# EAGLE design rekick2015-Prototyp-Sperrwandler (EAGLE 7.5.0)

## Sheet 1 of 7: Spannungsversorgung Primärseite
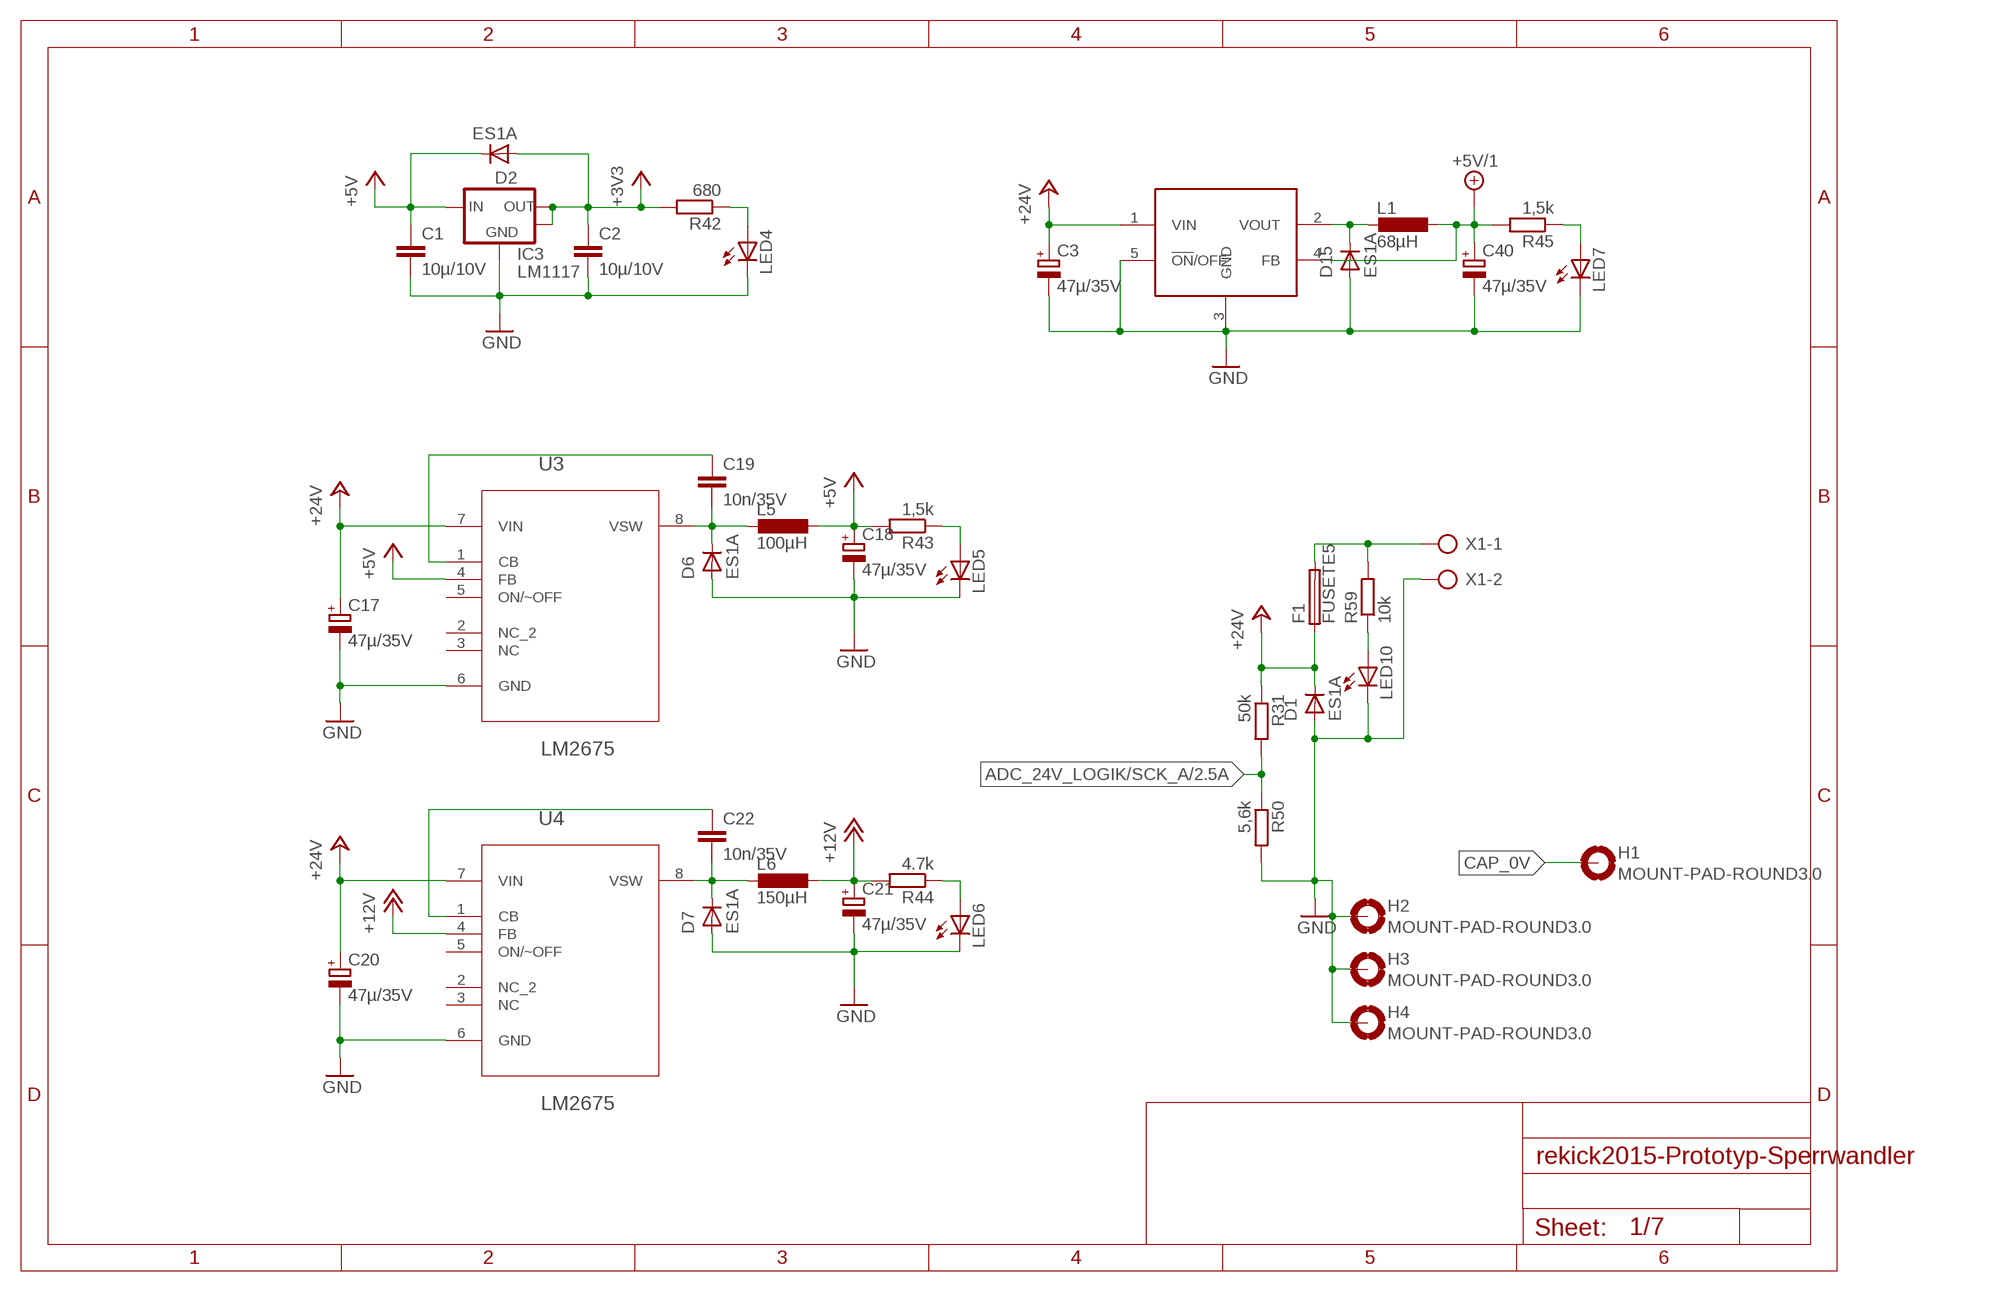
[diagram p0: schematic, sheet 1]

### Parts
C1  10µ/10V  C-EUC0603  [C0603]
C2  10µ/10V  C-EUC0603  [C0603]
C3  47µ/35V  CPOL-EUD  [PANASONIC_D]
C17  47µ/35V  CPOL-EUD  [PANASONIC_D]
C18  47µ/35V  CPOL-EUD  [PANASONIC_D]
C19  10n/35V  C-EUC0603  [C0603]
C20  47µ/35V  CPOL-EUD  [PANASONIC_D]
C21  47µ/35V  CPOL-EUD  [PANASONIC_D]
C22  10n/35V  C-EUC0603  [C0603]
C40  47µ/35V  CPOL-EUD  [PANASONIC_D]
D1  ES1A  GF1  [SMA-DO214AC]
D2  ES1A  GF1  [SMA-DO214AC]
D6  ES1A  GF1  [SMA-DO214AC]
D7  ES1A  GF1  [SMA-DO214AC]
D15  ES1A  GF1  [SMA-DO214AC]
F1  FUSETE5  [TE5]
H1  MOUNT-PAD-ROUND3.0  [3,0-PAD]
H2  MOUNT-PAD-ROUND3.0  [3,0-PAD]
H3  MOUNT-PAD-ROUND3.0  [3,0-PAD]
H4  MOUNT-PAD-ROUND3.0  [3,0-PAD]
IC3  LM1117  [SOT223]
L1  68µH  L-EUPISM  [PISM]
L5  100µH  L-EUPISM  [PISM]
L6  150µH  L-EUPISM  [PISM]
LED4  LEDCHIP-LED0805  [CHIP-LED0805]
LED5  LEDCHIP-LED0805  [CHIP-LED0805]
LED6  LEDCHIP-LED0805  [CHIP-LED0805]
LED7  LEDCHIP-LED0805  [CHIP-LED0805]
LED10  LEDCHIP-LED0805  [CHIP-LED0805]
R31  50k  R-EU_R0805  [R0805]
R42  680  R-EU_R0805  [R0805]
R43  1,5k  R-EU_R0805  [R0805]
R44  4.7k  R-EU_R0805  [R0805]
R45  1,5k  R-EU_R0805  [R0805]
R50  5,6k  R-EU_R0805  [R0805]
R59  10k  R-EU_R0805  [R0805]
U3  LM2675  LM2675M-3.3  [SOIC127P620X175-8N]
U4  LM2675  LM2675M-3.3  [SOIC127P620X175-8N]
U$8  LM2576  [TO220511]
X1  AK500/2-H  [AK500/2-H]

### Nets
+3V3: C2.1 D2.A IC3.2(OUT) IC3.4(OUT) R42.2 ; also sheet 3
+5V: C1.1 C18.+ D2.K(C) IC3.3(IN) L5.1 R43.2 U3.4(FB) ; also sheet 2,3,4,6,7
+5V/1: C40.+ L1.1 R45.2 U$8.4(FB) ; also sheet 6
+12V: C21.+ L6.1 R44.2 U4.4(FB)
+24V: C3.+ C17.+ C20.+ D1.K(C) F1.1 R31.1 U3.7(VIN) U4.7(VIN) U$8.1(VIN) ; also sheet 4,7
ADC_24V_LOGIK/SCK_A: R31.2 R50.1 ; also sheet 2
CAP_0V: H1.B3,0(MOUNT) ; also sheet 5,6,7
GND: C1.2 C2.2 C3.- C17.- C18.- C20.- C21.- C40.- D1.A D6.A D7.A D15.A H2.B3,0(MOUNT) H3.B3,0(MOUNT) H4.B3,0(MOUNT) IC3.1(GND) LED4.C LED5.C LED6.C LED7.C LED10.C R50.2 U3.6(GND) U4.6(GND) U$8.3(GND) U$8.5(!ON!/OFF) X1.2 ; also sheet 2,3,4,5,6,7
N$1: C19.2 D6.K(C) L5.2 U3.8(VSW)
N$3: C19.1 U3.1(CB)
N$26: C22.2 D7.K(C) L6.2 U4.8(VSW)
N$30: F1.2 R59.2 X1.1
N$33: C22.1 U4.1(CB)
N$67: LED4.A R42.1
N$69: D15.K(C) L1.2 U$8.2(VOUT)
N$71: LED7.A R45.1
N$72: LED5.A R43.1
N$73: LED6.A R44.1
N$77: LED10.A R59.1
Unconnected: U3.2(NC_2) U3.3(NC) U3.5(ON/~OFF) U4.2(NC_2) U4.3(NC) U4.5(ON/~OFF)

## Sheet 2 of 7: MCU
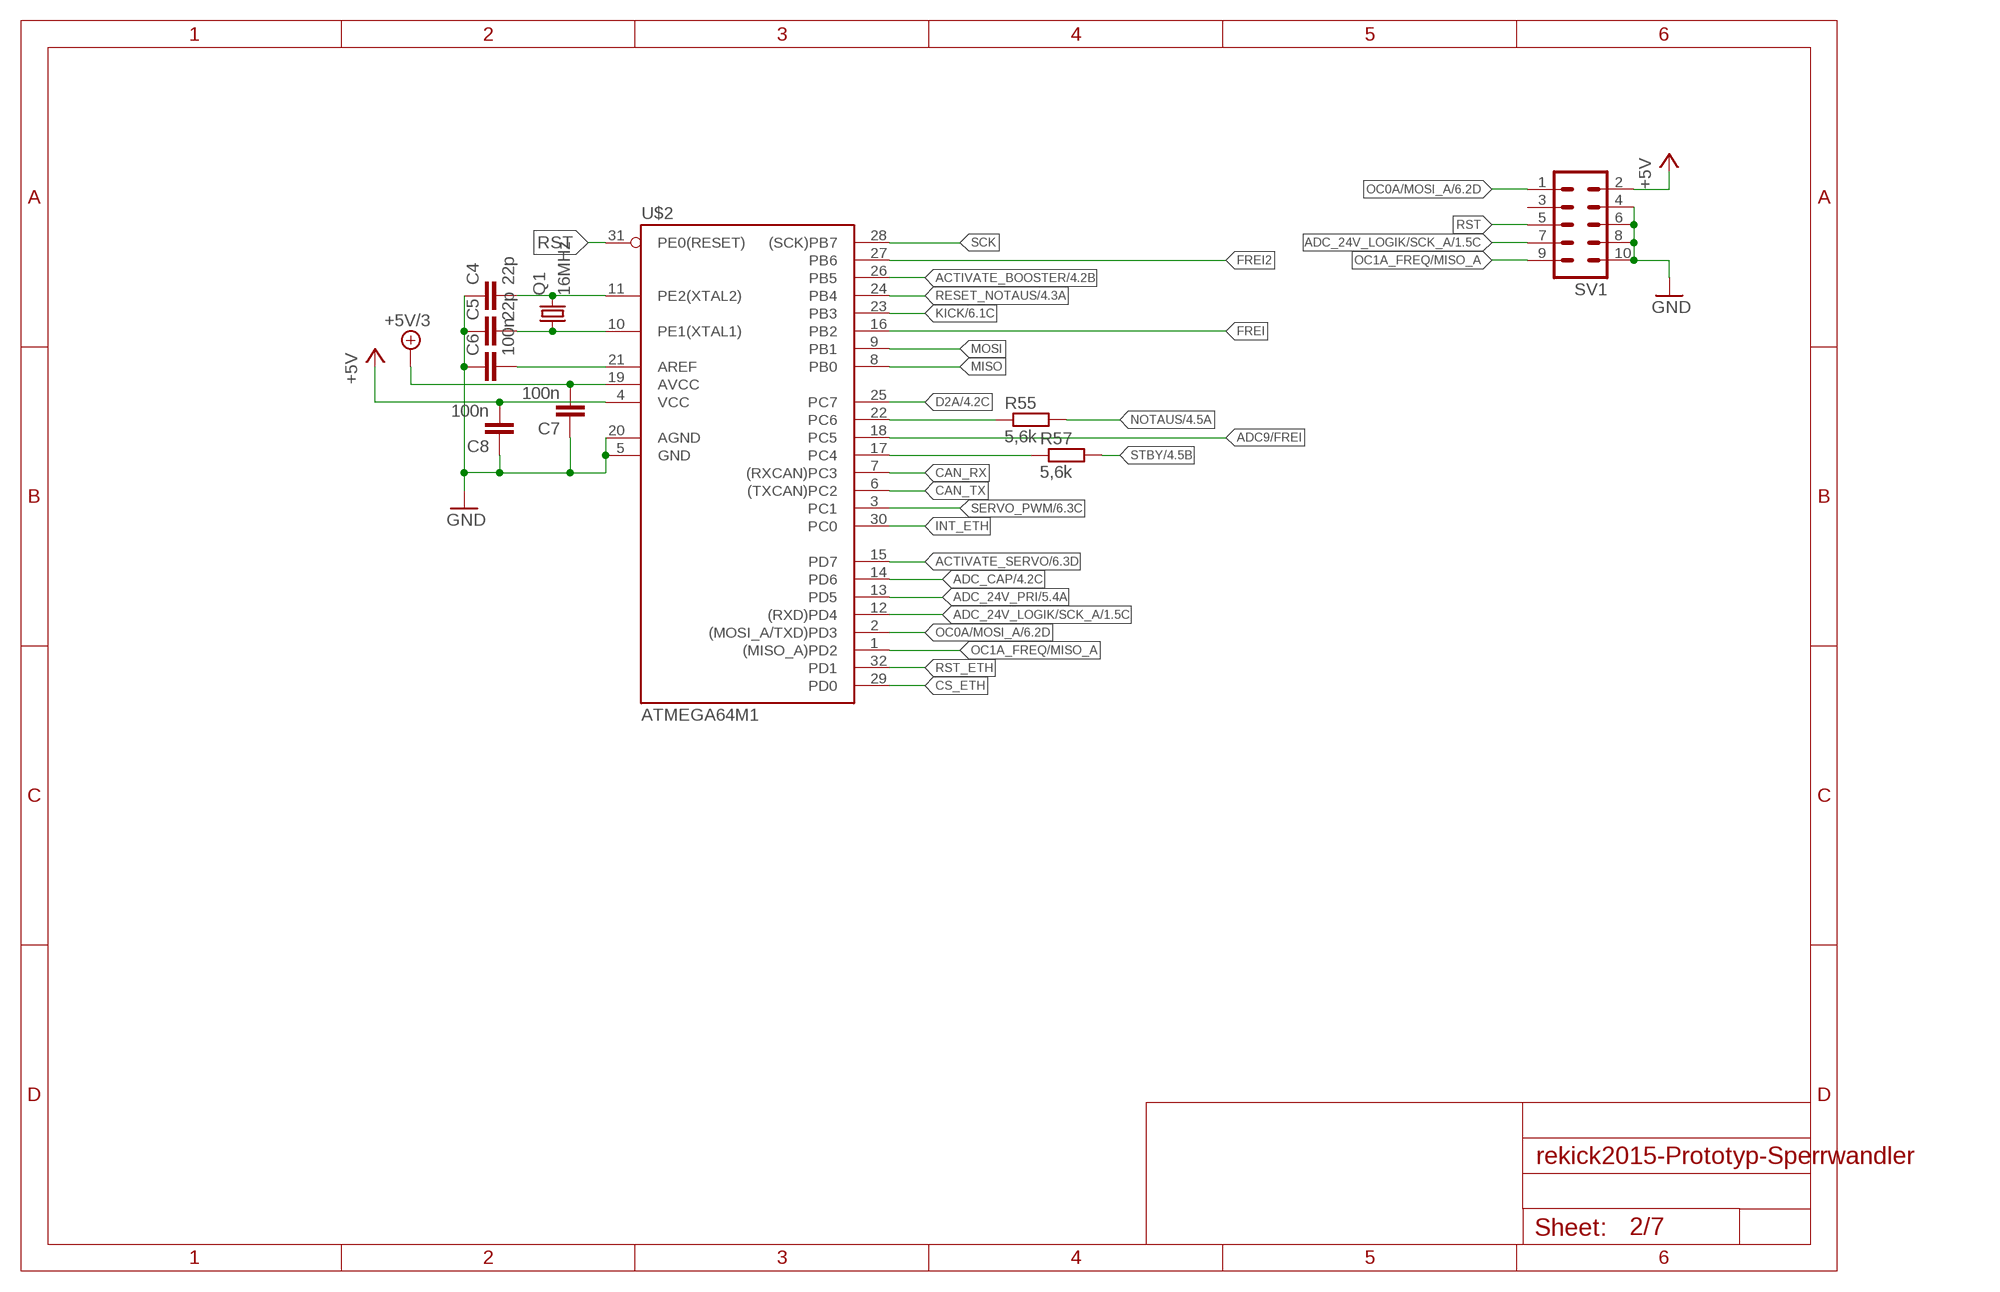
[diagram p1: schematic, sheet 2]

### Parts
C4  22p  C-EUC0603  [C0603]
C5  22p  C-EUC0603  [C0603]
C6  100n  C-EUC0603  [C0603]
C7  100n  C-EUC0603  [C0603]
C8  100n  C-EUC0603  [C0603]
Q1  16MHz  CRYSTALHC49UP  [HC49UP]
R55  5,6k  R-EU_R0805  [R0805]
R57  5,6k  R-EU_R0805  [R0805]
SV1  ML10  [ML10]
U$2  ATMEGA64M1  [TQFP32-08]

### Nets
+5V: C8.2 SV1.2 U$2.4(VCC) ; also sheet 1,3,4,6,7
+5V/3: C7.2 U$2.19(AVCC) ; also sheet 4,7
ACTIVATE_BOOSTER: U$2.26(PB5) ; also sheet 4,5
ACTIVATE_SERVO: U$2.15(PD7) ; also sheet 6
ADC9/FREI: U$2.18(PC5)
ADC_24V_LOGIK/SCK_A: SV1.7 U$2.12((RXD)PD4) ; also sheet 1
ADC_24V_PRI: U$2.13(PD5) ; also sheet 5
ADC_CAP: U$2.14(PD6) ; also sheet 4,7
CAN_RX: U$2.7((RXCAN)PC3) ; also sheet 3
CAN_TX: U$2.6((TXCAN)PC2) ; also sheet 3
CS_ETH: U$2.29(PD0) ; also sheet 3
D2A: U$2.25(PC7) ; also sheet 4
FREI: U$2.16(PB2)
FREI2: U$2.27(PB6)
GND: C4.1 C5.1 C6.1 C7.1 C8.1 SV1.4 SV1.6 SV1.8 SV1.10 U$2.5(GND) U$2.20(AGND) ; also sheet 1,3,4,5,6,7
INT_ETH: U$2.30(PC0) ; also sheet 3
KICK: U$2.23(PB3) ; also sheet 6
MISO: U$2.8(PB0) ; also sheet 3
MOSI: U$2.9(PB1) ; also sheet 3
N$5: C4.2 Q1.2 U$2.11(PE2(XTAL2))
N$6: C5.2 Q1.1 U$2.10(PE1(XTAL1))
N$10: C6.2 U$2.21(AREF)
N$51: R55.1 U$2.22(PC6)
N$59: R57.1 U$2.17(PC4)
NOTAUS: R55.2 ; also sheet 4,6
OC0A/MOSI_A: SV1.1 U$2.2((MOSI_A/TXD)PD3) ; also sheet 6
OC1A_FREQ/MISO_A: SV1.9 U$2.1((MISO_A)PD2)
RESET_NOTAUS: U$2.24(PB4) ; also sheet 4
RST: SV1.5 U$2.31(PE0(RESET))
RST_ETH: U$2.32(PD1) ; also sheet 3
SCK: U$2.28((SCK)PB7) ; also sheet 3
SERVO_PWM: U$2.3(PC1) ; also sheet 6
STBY: R57.2 ; also sheet 4
Unconnected: SV1.3

## Sheet 3 of 7: Ethernet & CAN
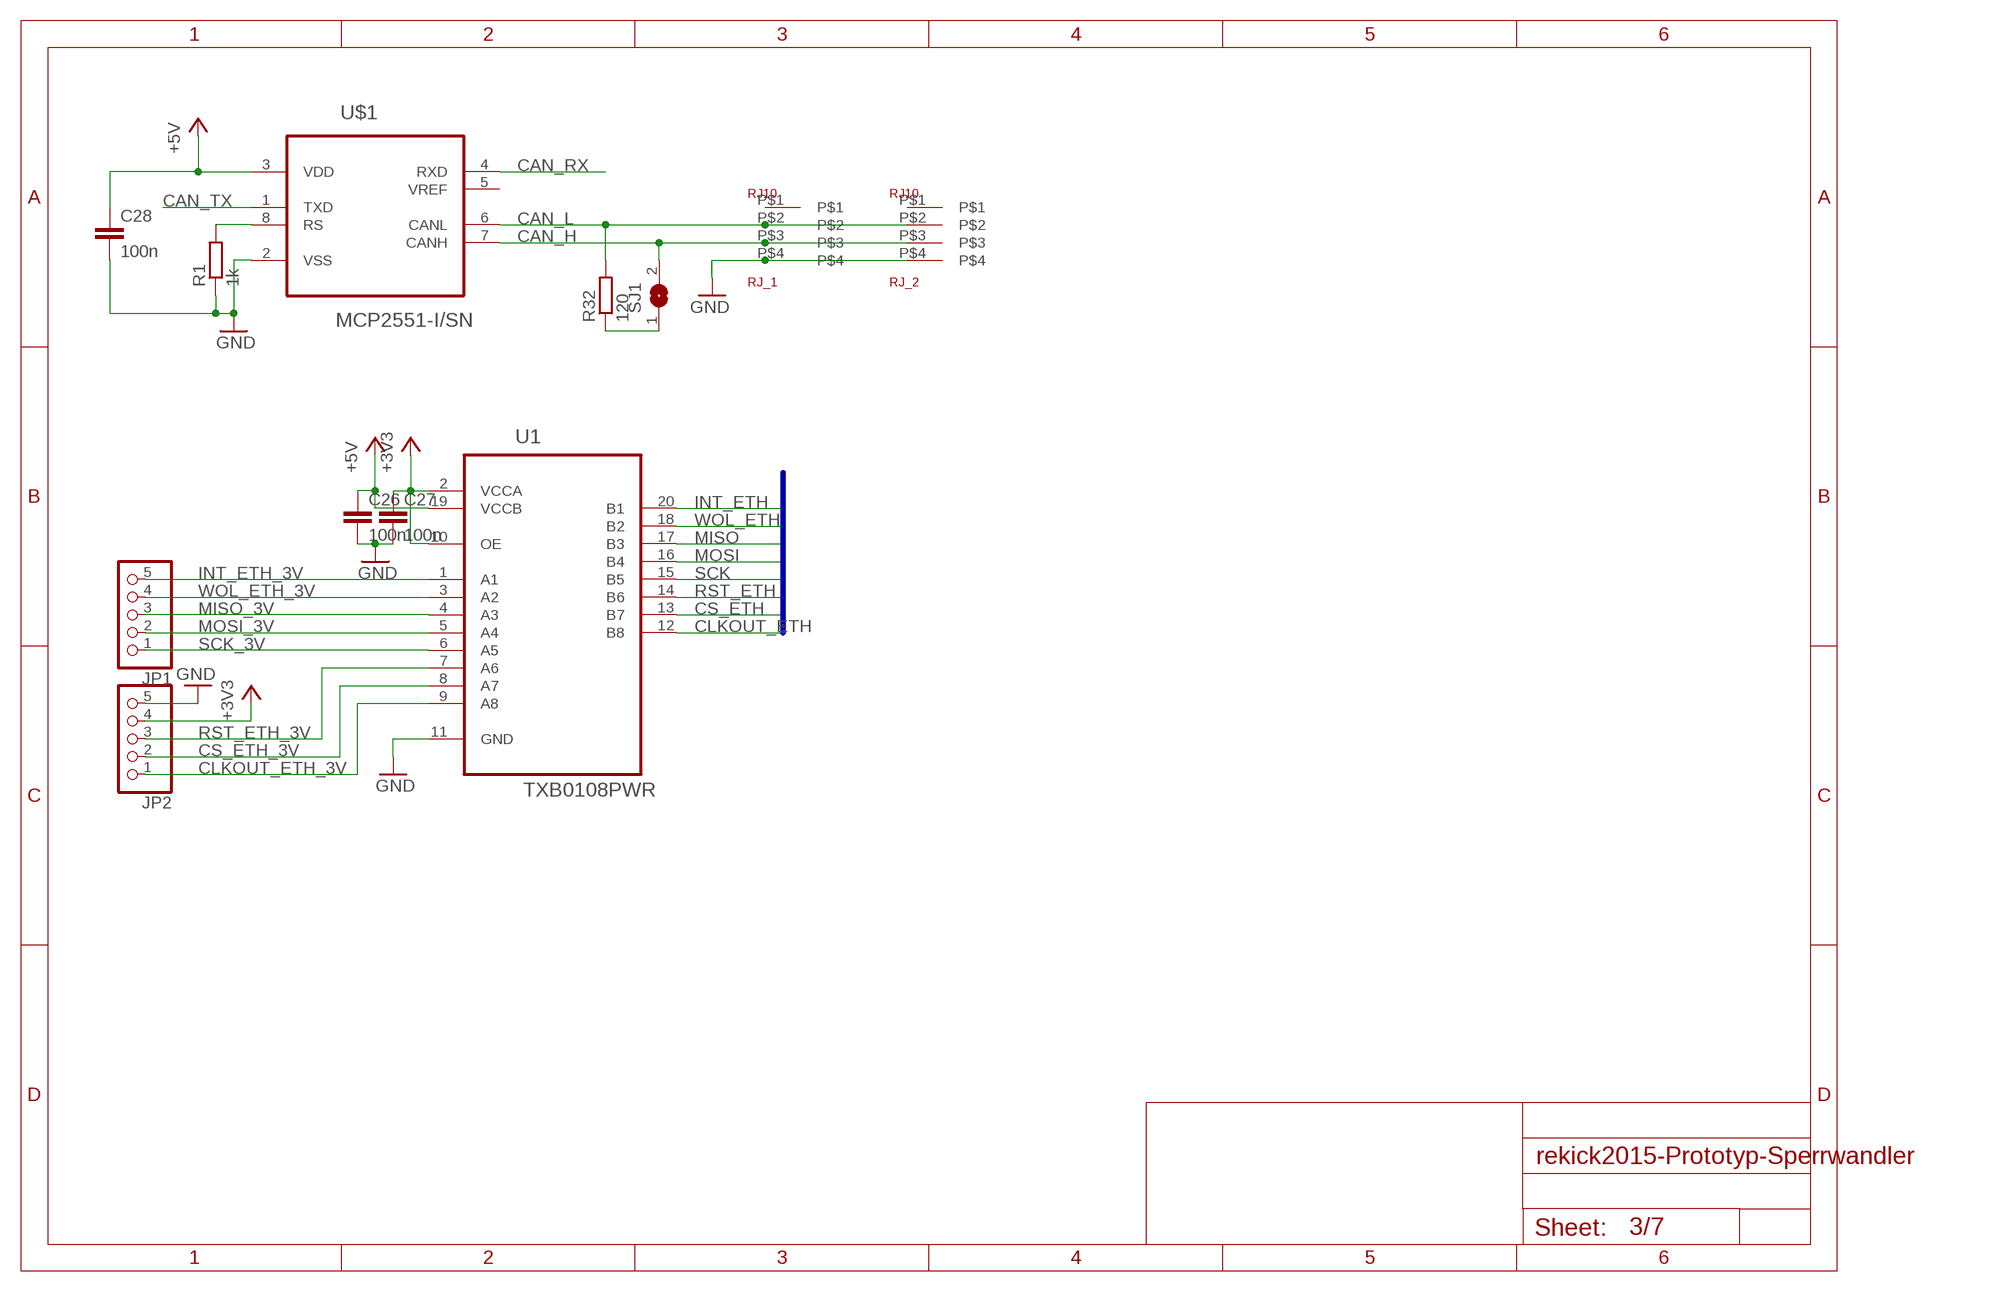
[diagram p2: schematic, sheet 3]

### Parts
C26  100n  C-EUC0603  [C0603]
C27  100n  C-EUC0603  [C0603]
C28  100n  C-EUC0603  [C0603]
JP1  PINHD-1X5  [1X05]
JP2  PINHD-1X5  [1X05]
R1  1k  R-EU_R0805  [R0805]
R32  120  R-EU_R0805  [R0805]
RJ_1  RJ10  [RJ10]
RJ_2  RJ10  [RJ10]
SJ1  SJ  [SJ]
U1  TXB0108PWR  [SOP65P640X120-20N]
U$1  MCP2551-I/SN  [SOIC127P600X175-8N]

### Nets
+3V3: C27.1 JP2.4 U1.2(VCCA) U1.10(OE) ; also sheet 1
+5V: C26.1 C28.1 U1.19(VCCB) U$1.3(VDD) ; also sheet 1,2,4,6,7
CAN_H: RJ_1.P$3 RJ_2.P$3 SJ1.2 U$1.7(CANH)
CAN_L: R32.2 RJ_1.P$2 RJ_2.P$2 U$1.6(CANL)
CAN_RX: U$1.4(RXD) ; also sheet 2
CAN_TX: U$1.1(TXD) ; also sheet 2
CLKOUT_ETH: U1.12(B8)
CLKOUT_ETH_3V: JP2.1 U1.9(A8)
CS_ETH: U1.13(B7) ; also sheet 2
CS_ETH_3V: JP2.2 U1.8(A7)
GND: C26.2 C27.2 C28.2 JP2.5 R1.1 RJ_1.P$4 RJ_2.P$4 U1.11(GND) U$1.2(VSS) ; also sheet 1,2,4,5,6,7
INT_ETH: U1.20(B1) ; also sheet 2
INT_ETH_3V: JP1.5 U1.1(A1)
MISO: U1.17(B3) ; also sheet 2
MISO_3V: JP1.3 U1.4(A3)
MOSI: U1.16(B4) ; also sheet 2
MOSI_3V: JP1.2 U1.5(A4)
N$4: R1.2 U$1.8(RS)
N$9: R32.1 SJ1.1
RST_ETH: U1.14(B6) ; also sheet 2
RST_ETH_3V: JP2.3 U1.7(A6)
SCK: U1.15(B5) ; also sheet 2
SCK_3V: JP1.1 U1.6(A5)
WOL_ETH: U1.18(B2)
WOL_ETH_3V: JP1.4 U1.3(A2)
Unconnected: RJ_1.P$1 RJ_2.P$1 U$1.5(VREF)

### Buses
INT_ETH,WOL_ETH,MISO,MOSI,SCK,RST_ETH,CS_ETH,CLKOUT_ETH

## Sheet 4 of 7: Notaus- und Burst-Logik
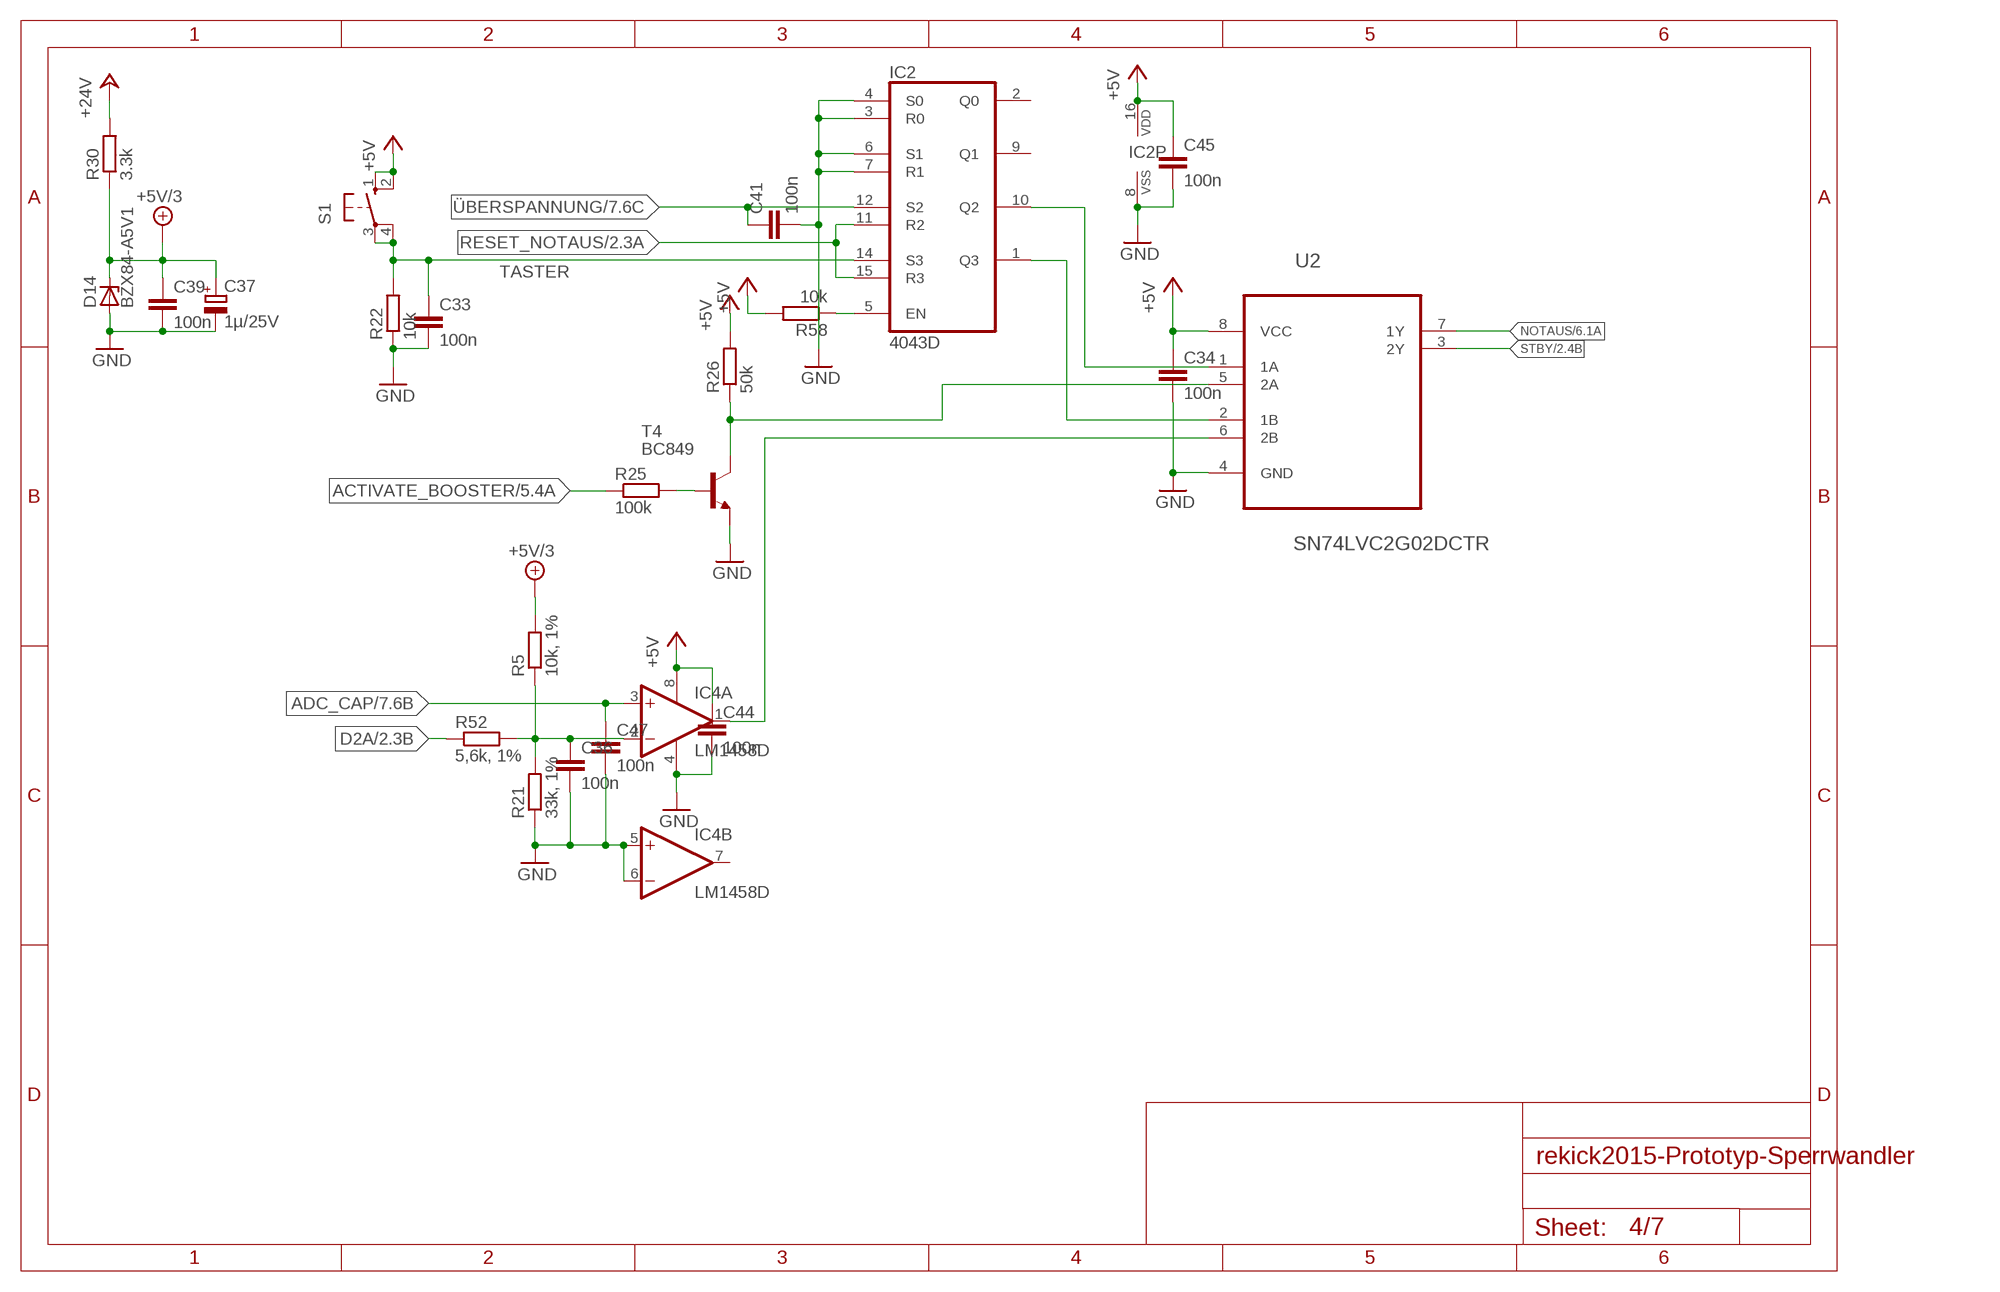
[diagram p3: schematic, sheet 4]

### Parts
C33  100n  C-EUC0603  [C0603]
C34  100n  C-EUC0603  [C0603]
C36  100n  C-EUC0603  [C0603]
C37  1µ/25V  CPOL-EUSMCA  [SMC_A]
C39  100n  C-EUC0603  [C0603]
C41  100n  C-EUC0603  [C0603]
C44  100n  C-EUC0603  [C0603]
C45  100n  C-EUC0603  [C0603]
C47  100n  C-EUC0603  [C0603]
D14  BZX84-A5V1  BZX84CSMD  [TO236]
IC2  4043D  [SO16]
IC4  LM1458D  [SO08]
R5  10k, 1%  R-EU_R0805  [R0805]
R21  33k, 1%  R-EU_R0805  [R0805]
R22  10k  R-EU_R0805  [R0805]
R25  100k  R-EU_R0805  [R0805]
R26  50k  R-EU_R0805  [R0805]
R30  3.3k  R-EU_R0805  [R0805]
R52  5,6k, 1%  R-EU_R0805  [R0805]
R58  10k  R-EU_R0805  [R0805]
S1  10-XX  [B3F-10XX]
T4  BC849  [SOT23]
U2  SN74LVC2G02DCTR  [SOP65P400X130-8N]

### Nets
+5V: C34.1 C44.1 C45.1 IC2.16(VDD) IC4.8(P:V+) R26.2 R58.2 S1.1(S) S1.2(S1) U2.8(VCC) ; also sheet 1,2,3,6,7
+5V/3: C37.+ C39.1 D14.C R5.2 R30.1 ; also sheet 2,7
+24V: R30.2 ; also sheet 1,7
ACTIVATE_BOOSTER: R25.1 ; also sheet 2,5
ADC_CAP: C47.1 IC4.3(A:+IN) ; also sheet 2,7
D2A: R52.1 ; also sheet 2
GND: C33.2 C34.2 C36.2 C37.- C39.2 C41.2 C44.2 C45.2 C47.2 D14.A IC2.3(R0) IC2.4(S0) IC2.6(S1) IC2.7(R1) IC2.8(VSS) IC4.4(P:V-) IC4.5(B:+IN) IC4.6(B:-IN) R21.1 R22.1 T4.2(E) U2.4(GND) ; also sheet 1,2,3,5,6,7
KICK_VOLTAGE: C36.1 IC4.2(A:-IN) R5.1 R21.2 R52.2
N$37: IC2.10(Q2) U2.1(1A)
N$38: IC2.1(Q3) U2.2(1B)
N$42: IC2.5(EN) R58.1
N$50: IC4.1(A:OUT) U2.6(2B)
N$52: R25.2 T4.1(B)
N$58: R26.1 T4.3(C) U2.5(2A)
NOTAUS: U2.7(1Y) ; also sheet 2,6
RESET_NOTAUS: IC2.11(R2) IC2.15(R3) ; also sheet 2
STBY: U2.3(2Y) ; also sheet 2
TASTER: C33.1 IC2.14(S3) R22.2 S1.3(P) S1.4(P1)
ÜBERSPANNUNG: C41.1 IC2.12(S2) ; also sheet 7
Unconnected: IC2.2(Q0) IC2.9(Q1) IC4.7(B:OUT)

## Sheet 5 of 7: Resonanz Controller
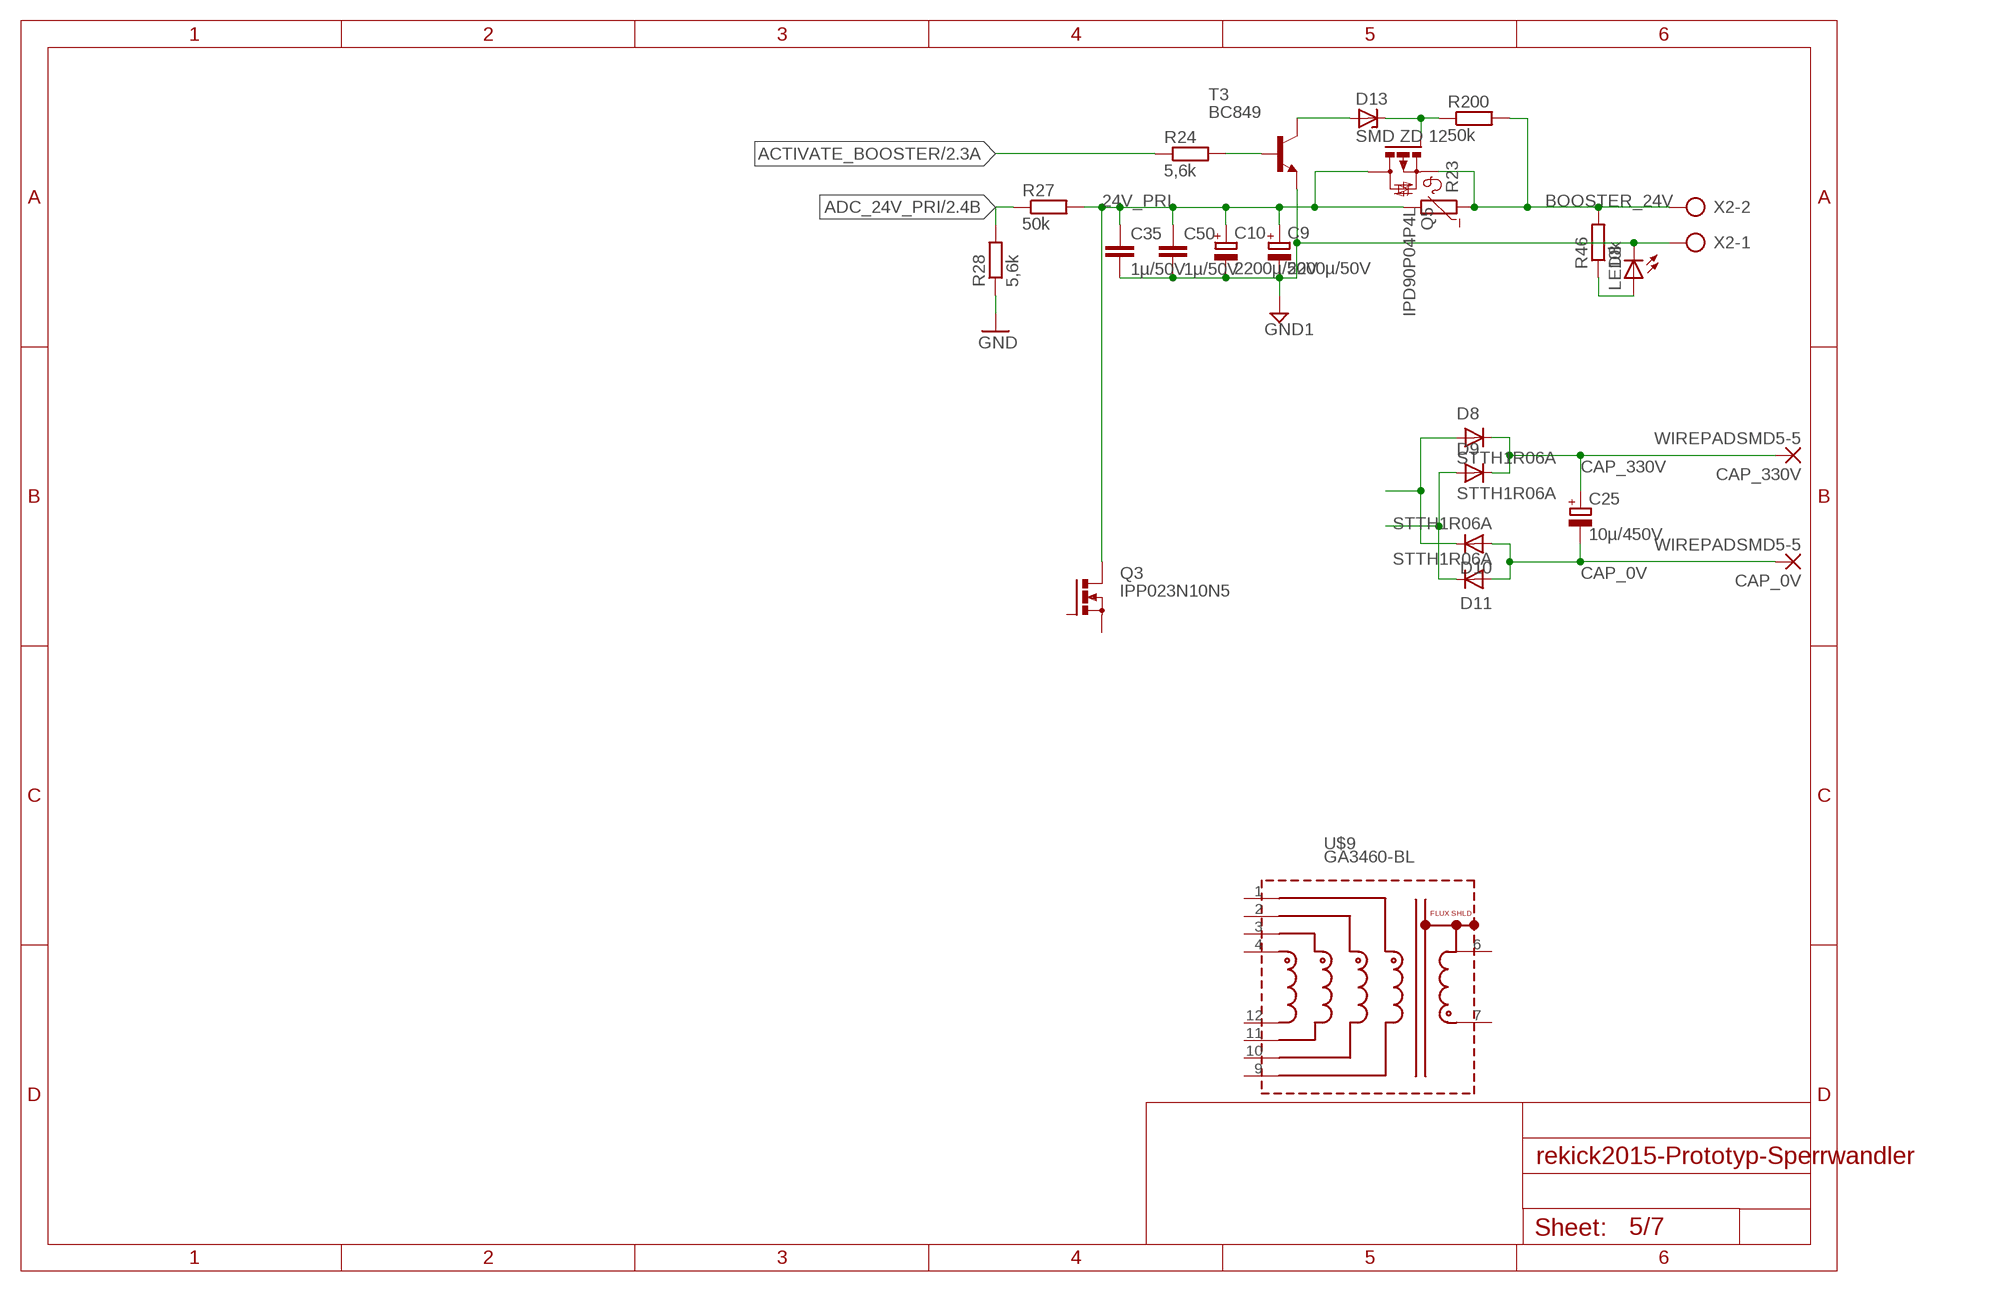
[diagram p4: schematic, sheet 5]

### Parts
C9  2200µ/50V  CPOL-EUE5-13  [E5-13]
C10  2200µ/50V  CPOL-EUE5-13  [E5-13]
C25  10µ/450V  CPOL-EUE5-10.5  [E5-10,5]
C35  1µ/50V  C-EUC1206  [C1206]
C50  1µ/50V  C-EUC1206  [C1206]
CAP_0V  WIREPADSMD5-5  [5-5]
CAP_330V  WIREPADSMD5-5  [5-5]
D8  STTH1R06A  GF1  [SMA-DO214AC]
D9  STTH1R06A  GF1  [SMA-DO214AC]
D10  STTH1R06A  GF1  [SMA-DO214AC]
D11  STTH1R06A  GF1  [SMA-DO214AC]
D13  SMD ZD 12  BZX84CSMD  [TO236]
LED8  LEDCHIP-LED0805  [CHIP-LED0805]
Q3  IPP023N10N5  PMOSFET_NTO220BV  [TO220BV]
Q5  IPD90P04P4L  IRFR5305  [D-PAK_TO252AA]
R23  NTC644A  [N644A]
R24  5,6k  R-EU_R0805  [R0805]
R27  50k  R-EU_R0805  [R0805]
R28  5,6k  R-EU_R0805  [R0805]
R46  10k  R-EU_R0805  [R0805]
R200  50k  R-EU_R0805  [R0805]
T3  BC849  [SOT23]
U$9  GA3460-BL  [GA3459]
X2  AK500/2-H  [AK500/2-H]

### Nets
24V_PRI: C9.+ C10.+ C35.1 C50.1 Q3.D Q5.4(D) R23.2 R27.2
ACTIVATE_BOOSTER: R24.1 ; also sheet 2,4
ADC_24V_PRI: R27.1 R28.2 ; also sheet 2
BOOSTER_24V: Q5.3(S) R23.1 R46.2 R200.2 X2.2
CAP_0V: C25.- CAP_0V.P$1(P) D10.A D11.A ; also sheet 1,6,7
CAP_330V: C25.+ CAP_330V.P$1(P) D8.K(C) D9.K(C) ; also sheet 6,7
GND: R28.1 ; also sheet 1,2,3,4,6,7
GND1: C9.- C10.- C35.2 C50.2 LED8.C T3.2(E) X2.1
N$34: D8.A D10.K(C)
N$36: D9.A D11.K(C)
N$54: D13.C Q5.1(G) R200.1
N$55: D13.A T3.3(C)
N$56: R24.2 T3.1(B)
N$74: LED8.A R46.1
Unconnected: Q3.G Q3.S U$9.1(W11) U$9.2(W21) U$9.3(W31) U$9.4(W41) U$9.6(S1) U$9.7(S2) U$9.9(W12) U$9.10(W22) U$9.11(W32) U$9.12(W42)

## Sheet 6 of 7: Notaus, Kicker, Servo
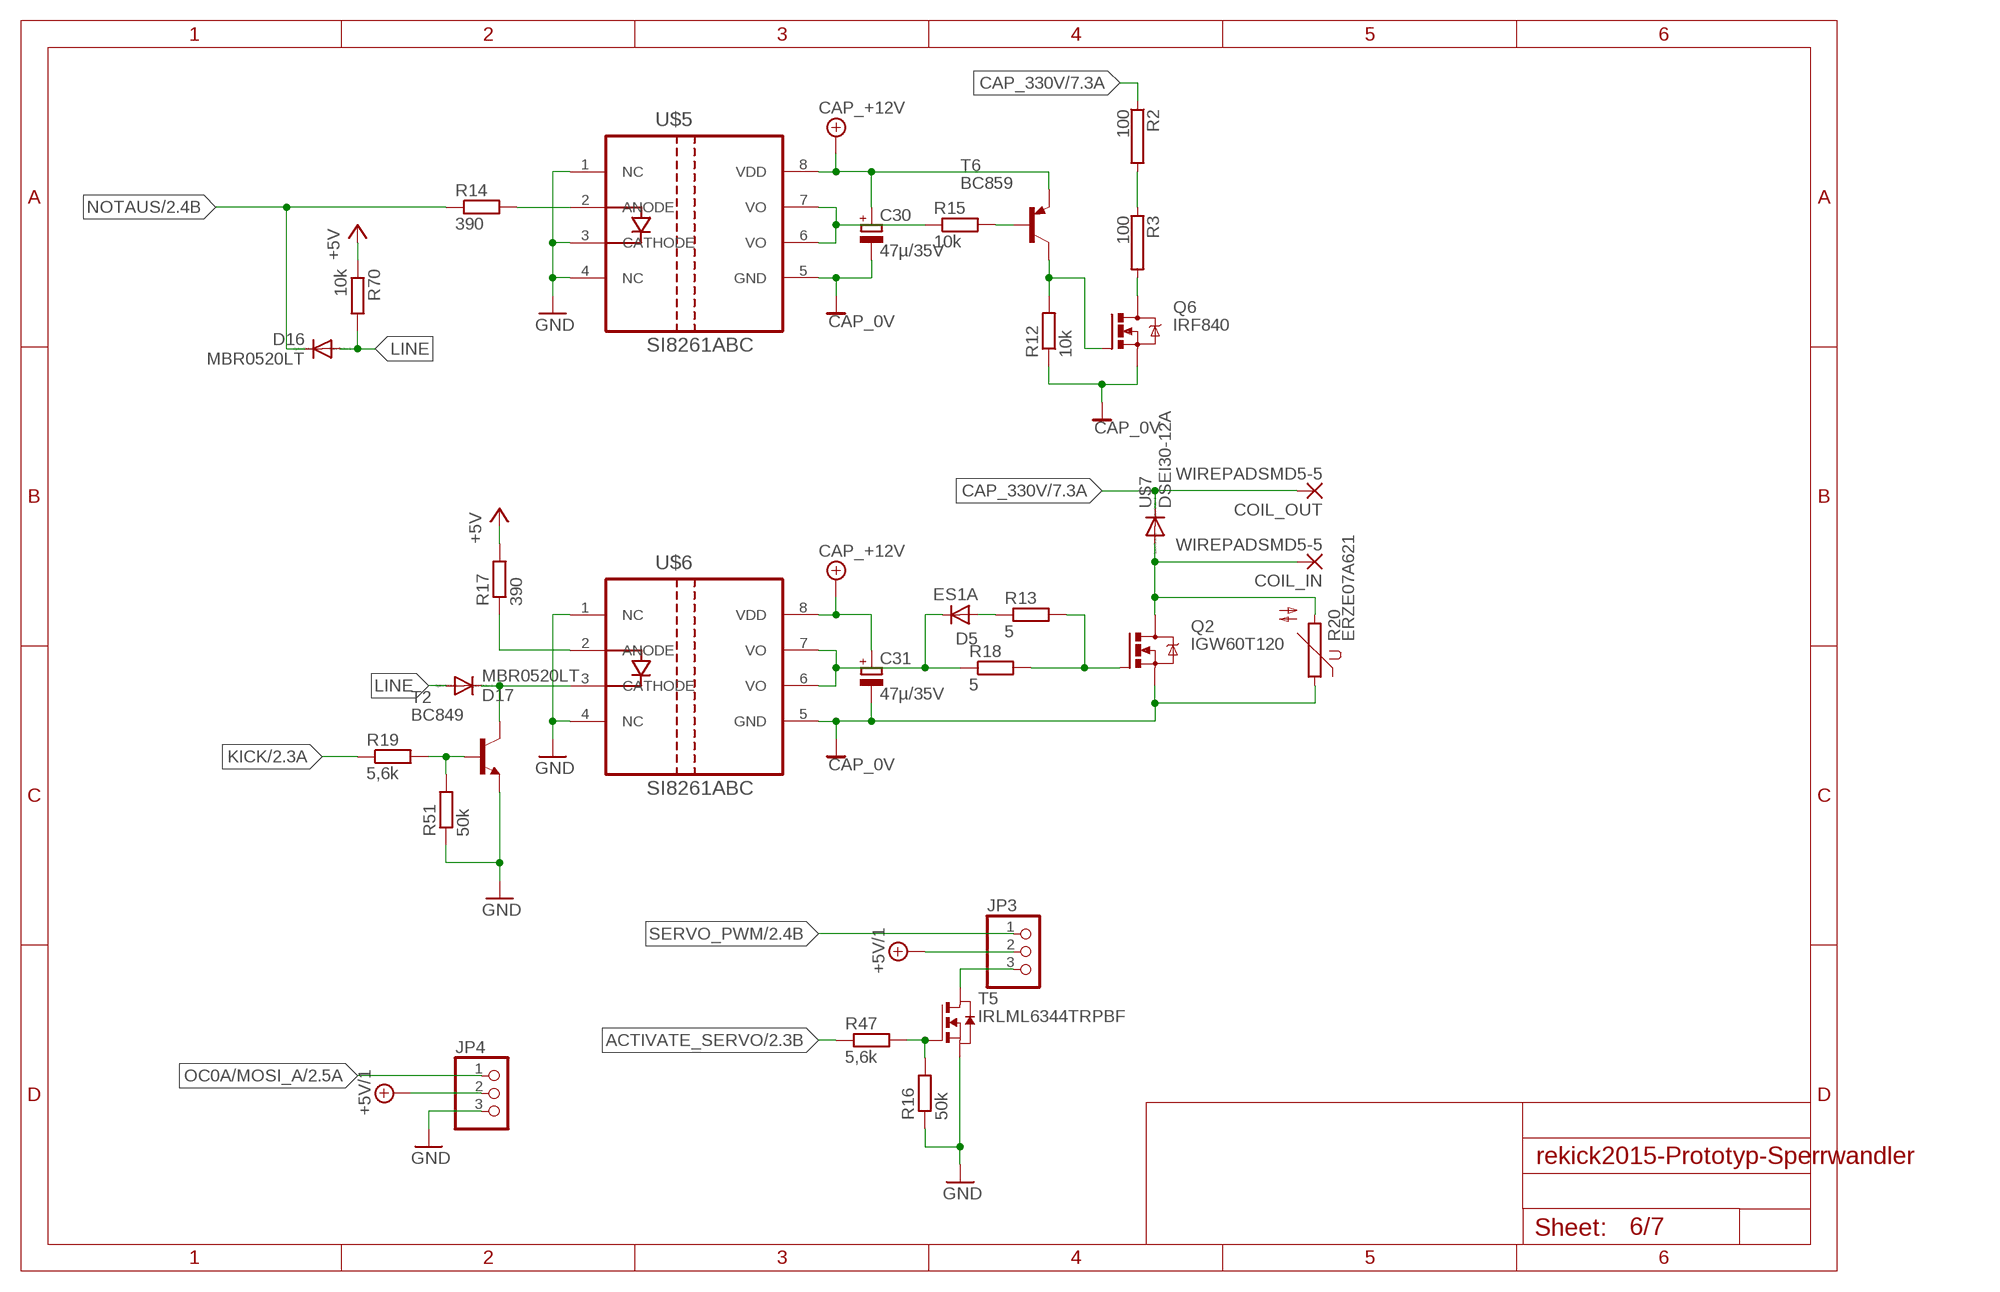
[diagram p5: schematic, sheet 6]

### Parts
C30  47µ/35V  CPOL-EUE2-5  [E2-5]
C31  47µ/35V  CPOL-EUE2-5  [E2-5]
COIL_IN  WIREPADSMD5-5  [5-5]
COIL_OUT  WIREPADSMD5-5  [5-5]
D5  ES1A  GF1  [SMA-DO214AC]
D16  MBR0520LT  [SOD123]
D17  MBR0520LT  [SOD123]
JP3  PINHD-1X3  [1X03]
JP4  PINHD-1X3  [1X03]
Q2  IGW60T120  IRFPC40  [TO247BV]
Q6  IRF840  IRF740  [TO220BV]
R2  100  RHS25  [HS25]
R3  100  RHS25  [HS25]
R12  10k  R-EU_R0805  [R0805]
R13  5  R-EU_R2512  [R2512]
R14  390  R-EU_R0805  [R0805]
R15  10k  R-EU_R0805  [R0805]
R16  50k  R-EU_R0805  [R0805]
R17  390  R-EU_R0805  [R0805]
R18  5  R-EU_R2512  [R2512]
R19  5,6k  R-EU_R0805  [R0805]
R20  ERZE07A621  S10K385  [S10K385]
R47  5,6k  R-EU_R0805  [R0805]
R51  50k  R-EU_R0805  [R0805]
R70  10k  R-EU_R0805  [R0805]
T2  BC849  [SOT23]
T5  IRLML6344TRPBF  NMOSSOT23  [SOT-23]
T6  BC859  BC858C-PNP-SOT23-BEC  [SOT23-BEC]
U$5  SI8261ABC  [SOIC-8]
U$6  SI8261ABC  [SOIC-8]
U$7  DSEI30-12A  [TO247AD]

### Nets
+5V: R17.2 R70.1 ; also sheet 1,2,3,4,7
+5V/1: JP3.2 JP4.2 ; also sheet 1
ACTIVATE_SERVO: R47.1 ; also sheet 2
CAP_0V: C30.- C31.- Q2.S Q6.S R12.1 R20.1 U$5.5(GND) U$6.5(GND) ; also sheet 1,5,7
CAP_330V: COIL_OUT.P$1(P) R2.1 U$7.C ; also sheet 5,7
CAP_+12V: C30.+ C31.+ T6.E U$5.8(VDD) U$6.8(VDD) ; also sheet 7
GND: JP4.3 R16.1 R51.1 T2.2(E) T5.2(S) U$5.1(NC) U$5.3(CATHODE) U$5.4(NC) U$6.1(NC) U$6.4(NC) ; also sheet 1,2,3,4,5,7
KICK: R19.1 ; also sheet 2
LINE: D16.A D17.A R70.2
N$23: R2.2 R3.1
N$24: Q6.D R3.2
N$39: Q6.G R12.2 T6.C
N$40: R14.2 U$5.2(ANODE)
N$41: R15.1 U$5.6(VO) U$5.7(VO)
N$43: R17.1 U$6.2(ANODE)
N$44: D5.K(C) R18.1 U$6.6(VO) U$6.7(VO)
N$45: D17.C T2.3(C) U$6.3(CATHODE)
N$46: R15.2 T6.B
N$47: R19.2 R51.2 T2.1(B)
N$48: Q2.G R13.2 R18.2
N$49: COIL_IN.P$1(P) Q2.D R20.2 U$7.A
N$53: D5.A R13.1
N$70: JP3.3 T5.1(D)
N$75: R16.2 R47.2 T5.3(G)
NOTAUS: D16.C R14.1 ; also sheet 2,4
OC0A/MOSI_A: JP4.1 ; also sheet 2
SERVO_PWM: JP3.1 ; also sheet 2

## Sheet 7 of 7: Überwachung/Monitoring
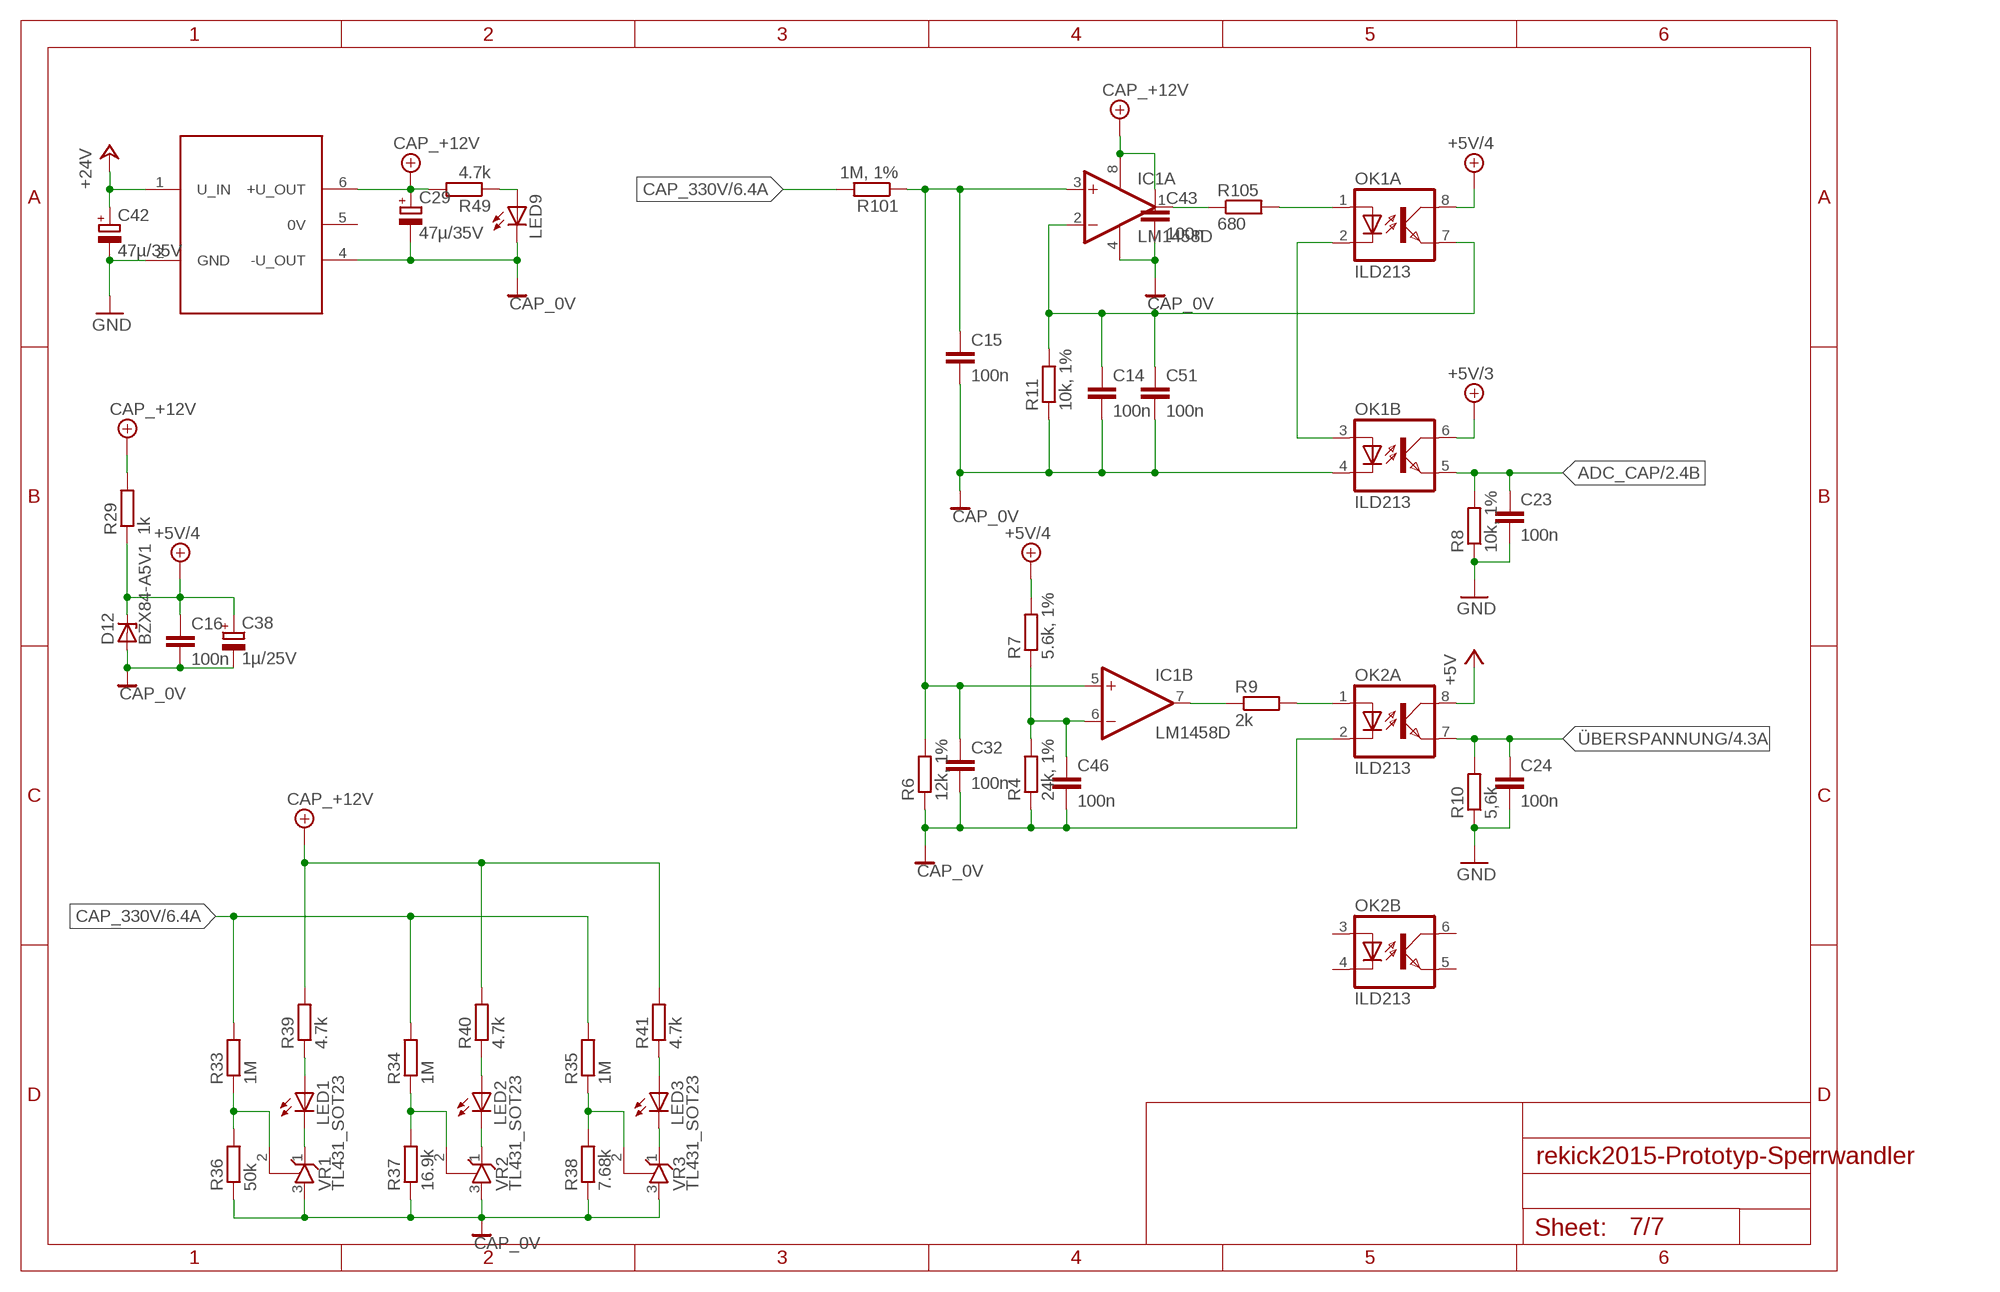
[diagram p6: schematic, sheet 7]

### Parts
C14  100n  C-EUC0603  [C0603]
C15  100n  C-EUC0603  [C0603]
C16  100n  C-EUC0603  [C0603]
C23  100n  C-EUC0603  [C0603]
C24  100n  C-EUC0603  [C0603]
C29  47µ/35V  CPOL-EUD  [PANASONIC_D]
C32  100n  C-EUC0603  [C0603]
C38  1µ/25V  CPOL-EUSMCA  [SMC_A]
C42  47µ/35V  CPOL-EUD  [PANASONIC_D]
C43  100n  C-EUC0603  [C0603]
C46  100n  C-EUC0603  [C0603]
C51  100n  C-EUC0603  [C0603]
D12  BZX84-A5V1  BZX84CSMD  [TO236]
IC1  LM1458D  [SO08]
LED1  LEDCHIP-LED0805  [CHIP-LED0805]
LED2  LEDCHIP-LED0805  [CHIP-LED0805]
LED3  LEDCHIP-LED0805  [CHIP-LED0805]
LED9  LEDCHIP-LED0805  [CHIP-LED0805]
OK1  ILD213  [SOIC08]
OK2  ILD213  [SOIC08]
R4  24k, 1%  R-EU_R0805  [R0805]
R6  12k, 1%  R-EU_R0805  [R0805]
R7  5.6k, 1%  R-EU_R0805  [R0805]
R8  10k, 1%  R-EU_R0805  [R0805]
R9  2k  R-EU_R0805  [R0805]
R10  5,6k  R-EU_R0805  [R0805]
R11  10k, 1%  R-EU_R0805  [R0805]
R29  1k  R-EU_R0805  [R0805]
R33  1M  R-EU_R2512  [R2512]
R34  1M  R-EU_R2512  [R2512]
R35  1M  R-EU_R2512  [R2512]
R36  50k  R-EU_R0805  [R0805]
R37  16.9k  R-EU_R0805  [R0805]
R38  7.68k  R-EU_R0805  [R0805]
R39  4.7k  R-EU_R0805  [R0805]
R40  4.7k  R-EU_R0805  [R0805]
R41  4.7k  R-EU_R0805  [R0805]
R49  4.7k  R-EU_R0805  [R0805]
R101  1M, 1%  R-EU_R2512  [R2512]
R105  680  R-EU_R0805  [R0805]
U$4  TMH-D  [TMH-D]
VR1  TL431_SOT23  [SOT23]
VR2  TL431_SOT23  [SOT23]
VR3  TL431_SOT23  [SOT23]

### Nets
+5V: OK2.8(A:COL) ; also sheet 1,2,3,4,6
+5V/3: OK1.6(B:COL) ; also sheet 2,4
+5V/4: C16.1 C38.+ D12.C OK1.8(A:COL) R7.2 R29.1
+24V: C42.+ U$4.1(U_IN) ; also sheet 1,4
ADC_CAP: C23.1 OK1.5(B:EMIT) R8.2 ; also sheet 2,4
CAP_0V: C14.2 C15.2 C16.2 C29.- C32.2 C38.- C43.2 C46.2 C51.2 D12.A IC1.4(P:V-) LED9.C OK1.4(B:C) OK2.2(A:C) R4.1 R6.1 R11.1 R36.1 R37.1 R38.1 U$4.4(-U_OUT) VR1.3(A) VR2.3(A) VR3.3(A) ; also sheet 1,5,6
CAP_330V: R33.2 R34.2 R35.2 R101.2 ; also sheet 5,6
CAP_+12V: C29.+ C43.1 IC1.8(P:V+) R29.2 R39.2 R40.2 R41.2 R49.2 U$4.6(+U_OUT) ; also sheet 6
GND: C23.2 C24.2 C42.- R8.1 R10.1 U$4.2(GND) ; also sheet 1,2,3,4,5,6
N$2: LED1.C VR1.1(C)
N$12: R33.1 R36.2 VR1.2(R)
N$13: IC1.1(A:OUT) R105.1
N$14: C14.1 C51.1 IC1.2(A:-IN) OK1.7(A:EMIT) R11.2
N$15: C15.1 C32.1 IC1.3(A:+IN) IC1.5(B:+IN) R6.2 R101.1
N$21: OK1.1(A:A) R105.2
N$22: OK1.2(A:C) OK1.3(B:A)
N$25: IC1.7(B:OUT) R9.1
N$27: C46.1 IC1.6(B:-IN) R4.2 R7.1
N$35: OK2.1(A:A) R9.2
N$60: R34.1 R37.2 VR2.2(R)
N$61: R35.1 R38.2 VR3.2(R)
N$62: LED2.C VR2.1(C)
N$63: LED3.C VR3.1(C)
N$64: LED1.A R39.1
N$65: LED2.A R40.1
N$66: LED3.A R41.1
N$76: LED9.A R49.1
ÜBERSPANNUNG: C24.1 OK2.7(A:EMIT) R10.2 ; also sheet 4
Unconnected: OK2.3(B:A) OK2.4(B:C) OK2.5(B:EMIT) OK2.6(B:COL) U$4.5(0V)

## Library data of the parts
C1 C2 C4-C8 C14-C16 C19 C22-C24 C26-C28 C32-C36 C39 C41 C43-C47 C50 C51 = rcl:C-EU: CAPACITOR, European symbol
C3 C9 C10 C17 C18 C20 C21 C25 C29-C31 C37 C38 C40 C42 = rcl:CPOL-EU: POLARIZED CAPACITOR, European symbol
CAP_0V CAP_330V COIL_IN COIL_OUT = mywirepad:WIREPAD: Wire PAD connect wire on PCB
D1 D2 D5-D11 D15 = diode:GF1: DIODE
D12-D14 = diode:BZX84CSMD: Z DIODE
D16 D17 = diode:MBR0520LT: SCHOTTKY BARRIER RECTIFIER Source: http://onsemi.com .. MBR0520LT1-D.pdf
F1 = fuse:FUSE: Fuse; OC_FARNELL: unknown; OC_NEWARK: unknown
H1-H4 = holes:MOUNT-PAD-ROUND: MOUNTING PAD, round
IC1 IC4 = linear:*1458: OP AMP
IC2 = 40xx:4043: Quad 3-state NOR R/S LATCH
IC3 = LM1117:LM1117
JP1 JP2 = pinhead:PINHD-1X5: PIN HEADER
JP3 JP4 = pinhead:PINHD-1X3: PIN HEADER
L1 L5 L6 = Inductor-Fastron:L-EU
LED1-LED10 = led:LED: LED OSRAM: - CHIPLED LG R971, LG N971, LY N971, LG Q971, LY Q971, LO R971, LY R971 LH N974, LH R974 LS Q976, LO Q976, LY Q976 LO Q996 - Hyper CHIPLED LW Q18S LB Q993, LB Q99A, LB R99A - SideLED LS A670, LO A670, LY A670, LG A670, LP A670 LB A673, LV A673, LT A673, LW A673 LH A674 LY A675 LS A676, LA A676, LO A676, LY A676, LW A676 LS A679, LY A679, LG A679 - Hyper Micro SIDELED® LS Y876, LA Y876, LO Y876, LY Y876 LT Y87S - SmartLED LW L88C, LW L88S LB L89C, LB L89S, LG L890 LS L89K, LO L89K, LY L89K LS L896, LA L896, LO L896, LY L896 - TOPLED LS T670, LO T670, LY T670, LG T670, LP T670 LSG T670, LSP T670, LSY T670, LOP T670, LYG T670 LG T671, LOG T671, LSG T671 LB T673, LV T673, LT T673, LW T673 LH T674 LS T676, LA T676, LO T676, LY T676, LB T676, LH T676, LSB T676, LW T676 LB T67C, LV T67C, LT T67C, LS T67K, LO T67K, LY T67K, LW E67C LS E67B, LA E67B, LO E67B, LY E67B, LB E67C, LV E67C, LT E67C LW T67C LS T679, LY T679, LG T679 LS T770, LO T770, LY T770, LG T770, LP T770 LB T773, LV T773, LT T773, LW T773 LH T774 LS E675, LA E675, LY E675, LS T675 LS T776, LA T776, LO T776, LY T776, LB T776 LHGB T686 LT T68C, LB T68C - Hyper Mini TOPLED® LB M676 - Mini TOPLED Santana® LG M470 LS M47K, LO M47K, LY M47K Source: http://www.osram.convergy.de LUXEON: - LUMILED® LXK2-PW12-R00, LXK2-PW12-S00, LXK2-PW14-U00, LXK2-PW14-V00 LXK2-PM12-R00, LXK2-PM12-S00, LXK2-PM14-U00 LXK2-PE12-Q00, LXK2-PE12-R00, LXK2-PE12-S00, LXK2-PE14-T00, LXK2-PE14-U00 LXK2-PB12-K00, LXK2-PB12-L00, LXK2-PB12-M00, LXK2-PB14-N00, LXK2-PB14-P00, LXK2-PB14-Q00 LXK2-PR12-L00, LXK2-PR12-M00, LXK2-PR14-Q00, LXK2-PR14-R00 LXK2-PD12-Q00, LXK2-PD12-R00, LXK2-PD12-S00 LXK2-PH12-R00, LXK2-PH12-S00 LXK2-PL12-P00, LXK2-PL12-Q00, LXK2-PL12-R00 Source: www.luxeon.com KINGBRIGHT: KA-3528ASYC Source: www.kingbright.com
OK1 OK2 = optocoupler:ILD2*: Siemens ILD205/206/207/211/213/217 DUAL PHOTOTRANSISTOR SMALL OUTLINE SURFACE MOUNT OPTOCOUPLER Source: 153385-da-01-en-Optocoupler_ILD205-T.pdf
Q1 = crystal:CRYSTAL: CRYSTAL
Q2 = transistor-power:IRFPC40: N-CHANNEL MOS FET
Q3 = transistor-power:PMOSFET_N: Power MOSFET N-Channel
Q5 = transistor-power:IRF?5305: HEXFET Power MOSFET Source: http://www.irf.com/product-info/datasheets/data/irfr5305pbf.pdf
Q6 = transistor-power:IRF740: N-CHANNEL MOS FET
R1 R4-R19 R21 R22 R24-R47 R49-R52 R55 R57-R59 R70 R101 R105 R200 = rcl:R-EU_: RESISTOR, European symbol
R2 R3 = resistor-power:R: Power Resitor
R20 = varistor:S10K385: VARISTOR
R23 = ptc-ntc:NTC644A: PHILIPS NTC
RJ_1 RJ_2 = ownParts:RJ10
S1 = switch-omron:10-XX: OMRON SWITCH
SJ1 = jumper:SJ: SMD solder JUMPER
SV1 = con-ml:ML10: HARTING
T2-T4 = transistor:BC849: NPN TRANSISTOR
T5 = zetex:NMOSSOT23: MOS FET; OC_FARNELL: unknown; OC_NEWARK: unknown
T6 = transistor:*-PNP-: PNP Transistror
U1 = TI-TXB0108PWR:TXB0108PWR: 8-BIT BIDIRECTIONAL VOLTAGE-LEVEL TRANSLATOR; MPN: TXB0108PWR; OC_FARNELL: 1494945; OC_NEWARK: 27M1151; PACKAGE: TSSOP-20; SUPPLIER: Texas Instruments
U2 = SN74LVC2G02DCTR:SN74LVC2G02DCTR: DUAL 2-INPUT POSITIVE-NOR GATE; MPN: SN74LVC2G02DCTR; OC_FARNELL: 1236358; OC_NEWARK: 94T5052; PACKAGE: SOP-8I; SUPPLIER: TEXAS INSTRUMENTS
U3 U4 = LM2675M-3.3:LM2675M-3.3: Step-Down Voltage Regulator; MPN: LM2675M-3.3; OC_FARNELL: 9489800; OC_NEWARK: 41K4140; PACKAGE: 8-SOIC; SUPPLIER: National Semiconductors
U$1 = Microchip-MCP2551-I_SN:MCP2551-I/SN: High-Speed CAN Transceiver; MPN: MCP2551-I/SN; OC_FARNELL: 9758569; OC_NEWARK: 69K7604; PACKAGE: SOIC-8; SUPPLIER: Microchip
U$2 = atmega16m1-32m1-64m1:ATMEGA64M1
U$4 = traco-tm:TMH-D
U$5 U$6 = Si8261:SI8261ABC
U$7 = dsei30-12a:DSEI30-12A
U$8 = LM2576:LM2576
U$9 = inductor-coilcraft-2b:GA3460-BL: Coilcraft GA3460 Flyback Transformers for Linear Technology LT3751 Description: COTS flyback transformer for 50-500V capacitor charger circuits. For similar functionality, check out LT3757 in conjunction with Coilcraft DA2032..DA2034. Features: Flyback transformer for the Linear Technology LT3751 Capacitor Charger Controller for charging capacitors to 500 V GA3459-BL: 5 – 24 V input; GA3460-BL: 12 – 24 V input 1500 Vrms, one minute isolation from primary to secondary windings Flux shield minimizes EMI emission Part-No. L (µH) @ I=0A L (µH) @ Ipk DCR (mOhm) prim. DCR (mOhm) sec. Lleak (µH) T prim:sec Ipk (A) GA3459-BL 5.0 4.25 7.70 515 0.10 1 : 10 20 GA3460-BL 2.5 2.25 5.63 400 0.06 1 : 10 50 Datasheet: http://www.coilcraft.com/pdfs/ga3459.pdf
VR1-VR3 = 1_USER:TL431
X1 X2 = con-ptr500:AK500/2-H: CONNECTOR Aug. 2004 / PTR Meßtechnik: Die Bezeichnung der Serie AK505 wurde geändert. Es handelt sich hierbei um AK500 in horizontaler Ausführung.; OC_FARNELL: unknown; OC_NEWARK: unknown

## Board
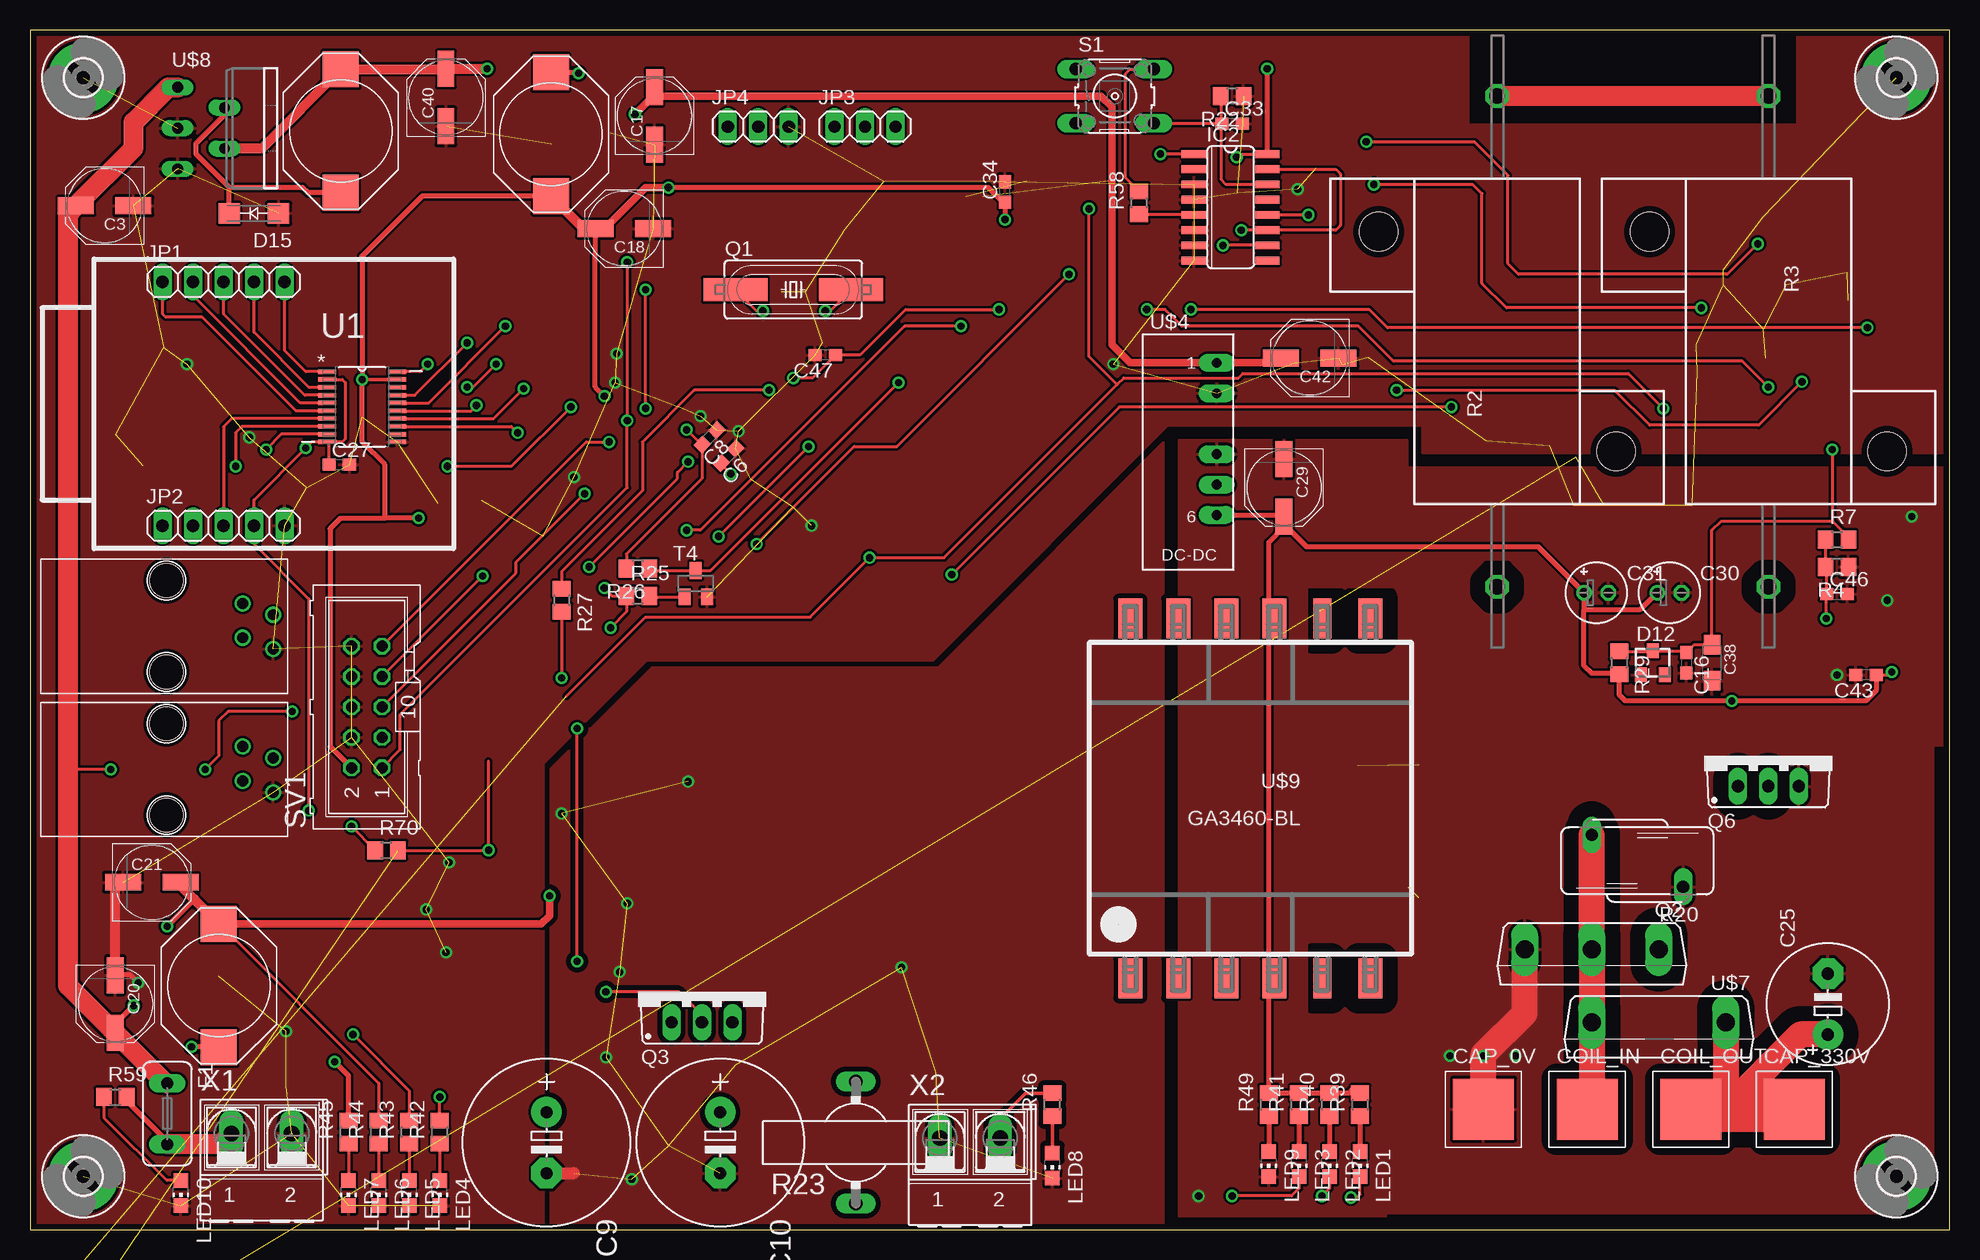
[diagram p7: board, top side]
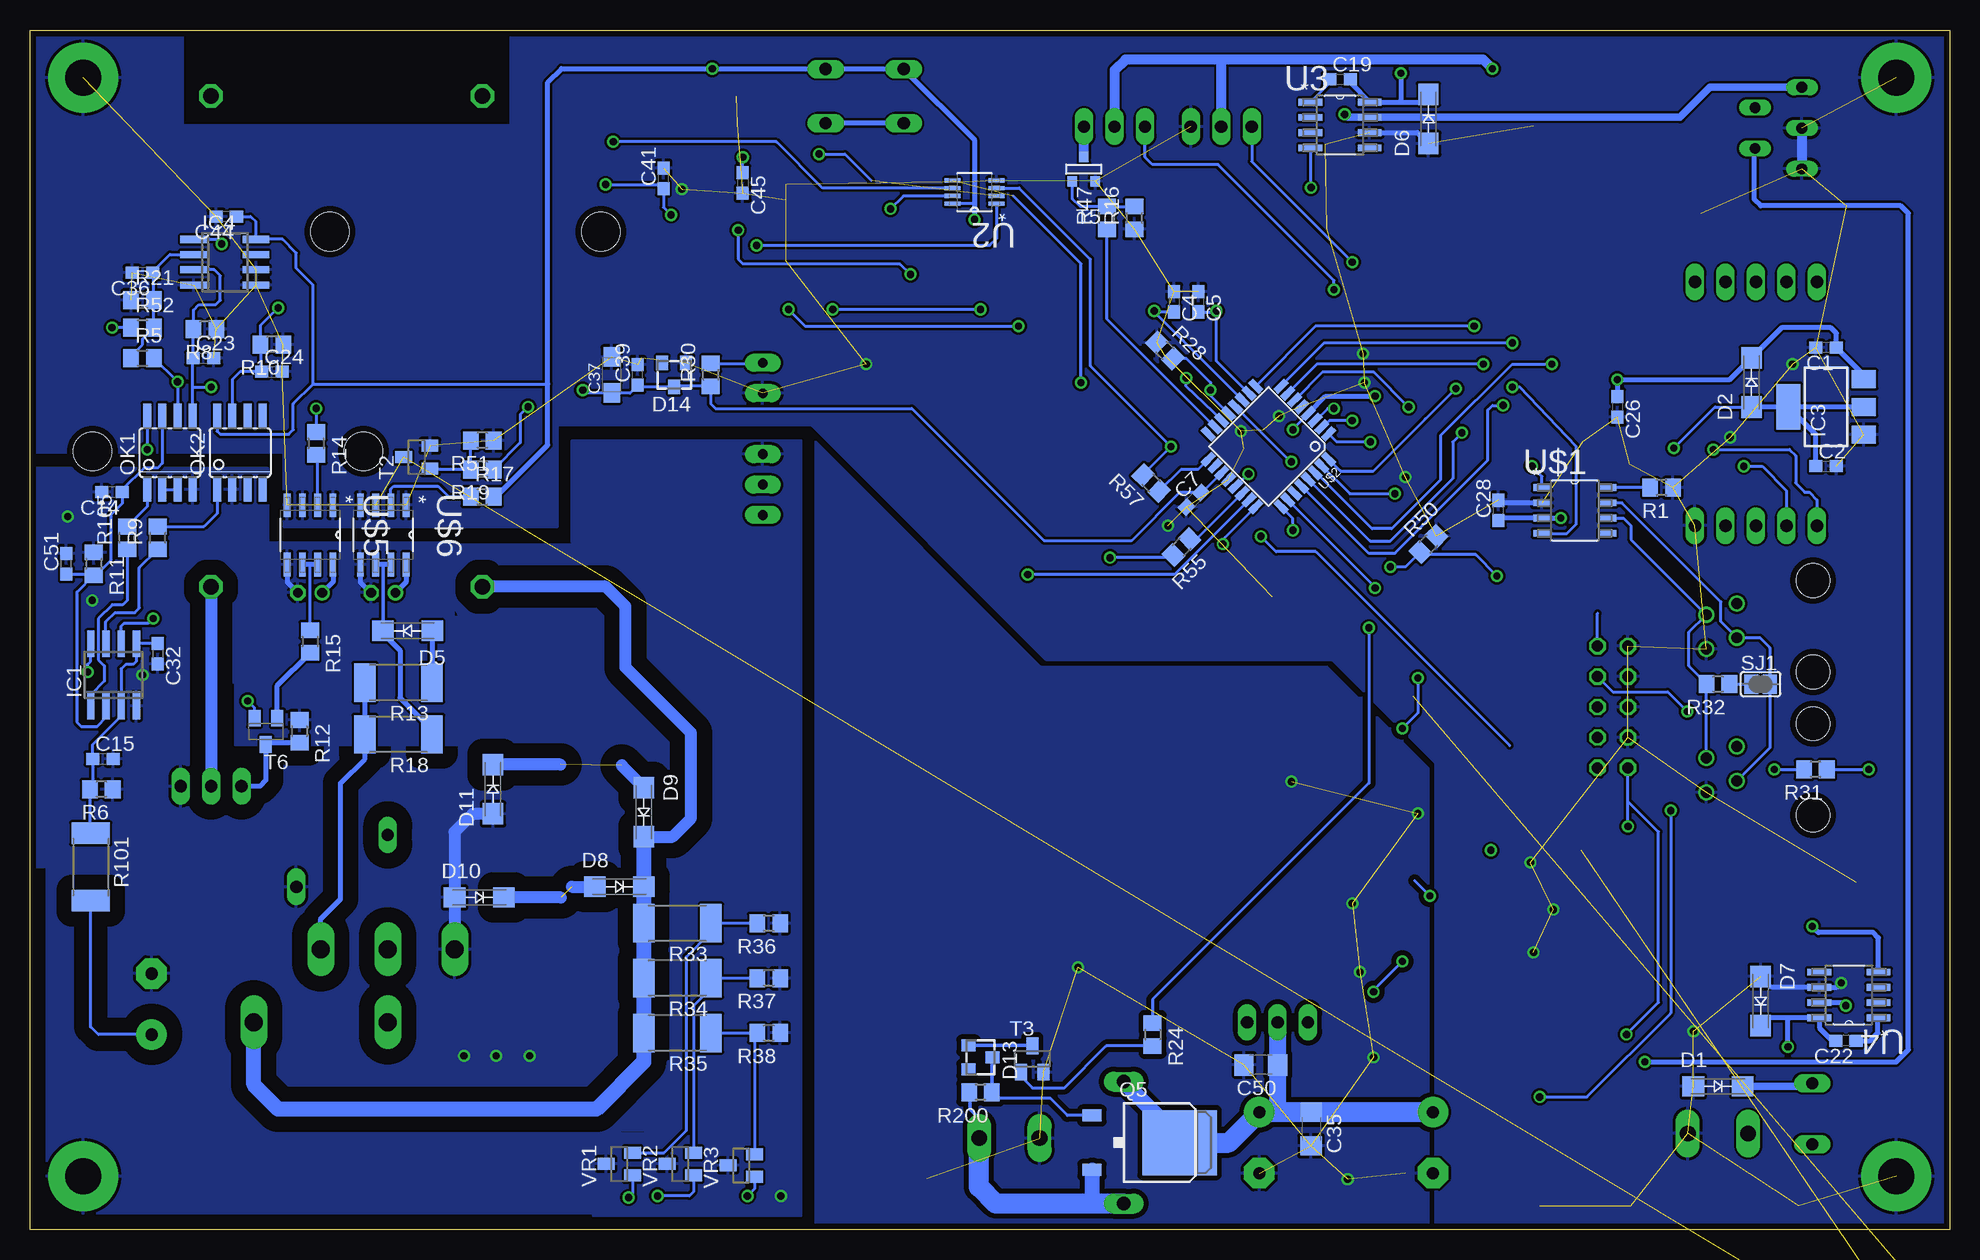
[diagram p8: board, bottom side, seen from below]

Size 160 x 100 mm. Coordinates in mm from the lower left corner, seen from the top.
Outline: 0,0 160,0 160,100 0,100 0,0
Copper layers (1*16): Top 0.035mm / dielectric 1.5mm / Bottom 0.035mm
Design rules "qp_designrules_8mil": minimum track width 8mil, minimum drill 20mil, track to track 8mil, track to pad 8mil, pad to pad 8mil, via to via 8mil, smd to smd 8mil, copper to edge 20mil, drill to drill 20mil, minimum pad ring 8mil, minimum via ring 8mil, stop-mask expansion 2mil, vias tented up to drill 0mil, thermal gap 10mil

### Footprints (pad centres in the part's own frame; a part is rotated, then mirrored left to right if it is on the bottom)
C0603 = smd 1.1 x 1: 1 -0.85,0; 2 0.85,0
PANASONIC_D = smd 3 x 1.4: + 2.4,0; - -2.4,0
E5-13 = drill 1.016 pad 2.54: + -2.54,0 | drill 1.016 pad 2.54 octagon: - 2.54,0
E5-10,5 = drill 1.016 pad 2.54: + -2.54,0 | drill 1.016 pad 2.54 octagon: - 2.54,0
E2-5 = drill 0.813 pad 1.27: + -1.016,0 | drill 0.813 pad 1.27 octagon: - 1.016,0
C1206 = smd 1.6 x 1.8: 1 -1.4,0; 2 1.4,0
SMC_A = smd 1.6 x 1.4: + -1.5,0; - 1.5,0
5-5 = smd 5.08 x 5.08: P$1 0,0
SMA-DO214AC = smd 1.8 x 1.7: A -2.05,0; K 2.05,0
TO236 = smd 1 x 1.2: A -1,-1; C 0,1; NC 1,-1
SOD123 = smd 1.4 x 1.4: A 1.9,0; C -1.9,0
TE5 = drill 1.016 long: 1 -2.54,0; 2 2.54,0
3,0-PAD = drill 3 pad 5.842: B3,0 0,0
SO08 = smd 0.6 x 2.2: 1 -1.905,-2.6; 2 -0.635,-2.6; 3 0.635,-2.6; 4 1.905,-2.6; 5 1.905,2.6; 6 0.635,2.6; 7 -0.635,2.6; 8 -1.905,2.6
SO16 = smd 0.66 x 2.032: 1 -4.445,-3.073; 2 -3.175,-3.073; 3 -1.905,-3.073; 4 -0.635,-3.073; 5 0.635,-3.073; 6 1.905,-3.073; 7 3.175,-3.073; 8 4.445,-3.073; 9 4.445,3.073; 10 3.175,3.073; 11 1.905,3.073; 12 0.635,3.073; 13 -0.635,3.073; 14 -1.905,3.073; 15 -3.175,3.073; 16 -4.445,3.073
SOT223 = smd 1.5 x 2: 1 -2.3,-3.15; 2 0,-3.15; 3 2.3,-3.15 | smd 3.8 x 2: 4 0,3.15
1X05 = drill 1.016 long: 1 -5.08,0; 2 -2.54,0; 3 0,0; 4 2.54,0; 5 5.08,0
1X03 = drill 1.016 long: 1 -2.54,0; 2 0,0; 3 2.54,0
PISM = smd 3 x 3: 1 -5.15,0; 2 5.15,0
CHIP-LED0805 = smd 1.2 x 1.2: A 0,-1.05; C 0,1.05
SOIC08 = smd 0.66 x 2.032: 1 -1.905,-3.073; 2 -0.635,-3.073; 3 0.635,-3.073; 4 1.905,-3.073; 5 1.905,3.073; 6 0.635,3.073; 7 -0.635,3.073; 8 -1.905,3.073
HC49UP = smd 5.334 x 1.93: 1 -4.826,0; 2 4.826,0
TO247BV = drill 1.499 long: D 0,-2.921; G -5.588,-2.921; S 5.588,-2.921
TO220BV = drill 1.016 long: D 0,-2.54; G -2.54,-2.54; S 2.54,-2.54
D-PAK_TO252AA = smd 1 x 1.6: 1 -2.28,-4.8; 3 2.28,-4.8 | smd 5.4 x 6.2: 4 0,2.5
R0805 = smd 1.3 x 1.5: 1 -0.95,0; 2 0.95,0
HS25 = drill 1.3 octagon: 1 -20.47,0; 2 20.47,0 | hole 3.2: 9.15,9.9; -9.15,-9.9
R2512 = smd 1.8 x 3.2: 1 -2.8,0; 2 2.8,0
S10K385 = drill 1.016 long: 1 -2.159,-3.81; 2 2.159,3.81
N644A = drill 1.118 long: 1 -5.08,0; 2 5.08,0
RJ10 = drill 0.9: P$1 -1.905,6.55; P$2 -0.953,9.09; P$3 0.953,6.55; P$4 1.905,9.09 | hole 2.8: -3.81,0.2; 3.81,0.2
B3F-10XX = drill 1.016 long: 1 -3.251,2.261; 2 3.251,2.261; 3 -3.251,-2.261; 4 3.251,-2.261
SJ = smd 1.168 x 1.6: 1 -0.762,0; 2 0.762,0
ML10 = drill 0.914 octagon: 1 -5.08,-1.27; 2 -5.08,1.27; 3 -2.54,-1.27; 4 -2.54,1.27; 5 0,-1.27; 6 0,1.27; 7 2.54,-1.27; 8 2.54,1.27; 9 5.08,-1.27; 10 5.08,1.27
SOT23 = smd 1 x 1.4: 1 -0.95,-1.1; 2 0.95,-1.1; 3 0,1.1
SOT-23 = smd 0.787 x 0.889: 1 0.025,-1.016; 2 -0.94,1.016; 3 0.991,1.016
SOT23-BEC = smd 1 x 1.4: B -0.95,-1.1; C 0,1.1; E 0.95,-1.1
SOP65P640X120-20N = smd 1.473 x 0.356: 1 -2.921,2.921; 2 -2.921,2.286; 3 -2.921,1.626; 4 -2.921,0.965; 5 -2.921,0.33; 6 -2.921,-0.33; 7 -2.921,-0.965; 8 -2.921,-1.626; 9 -2.921,-2.286; 10 -2.921,-2.921; 11 2.921,-2.921; 12 2.921,-2.286; 13 2.921,-1.626; 14 2.921,-0.965; 15 2.921,-0.33; 16 2.921,0.33; 17 2.921,0.965; 18 2.921,1.626; 19 2.921,2.286; 20 2.921,2.921
SOP65P400X130-8N = smd 1.321 x 0.356: 1 -1.829,0.965; 2 -1.829,0.33; 3 -1.829,-0.33; 4 -1.829,-0.965; 5 1.829,-0.965; 6 1.829,-0.33; 7 1.829,0.33; 8 1.829,0.965
SOIC127P620X175-8N = smd 1.981 x 0.559: 1 -2.464,1.905; 2 -2.464,0.635; 3 -2.464,-0.635; 4 -2.464,-1.905; 5 2.464,-1.905; 6 2.464,-0.635; 7 2.464,0.635; 8 2.464,1.905
SOIC127P600X175-8N = smd 1.473 x 0.559: 1 -2.718,1.905; 2 -2.718,0.635; 3 -2.718,-0.635; 4 -2.718,-1.905; 5 2.718,-1.905; 6 2.718,-0.635; 7 2.718,0.635; 8 2.718,1.905
TQFP32-08 = smd 1.27 x 0.559: 1 -4.293,2.8; 2 -4.293,2; 3 -4.293,1.2; 4 -4.293,0.4; 5 -4.293,-0.4; 6 -4.293,-1.2; 7 -4.293,-2; 8 -4.293,-2.8; 17 4.293,-2.8; 18 4.293,-2; 19 4.293,-1.2; 20 4.293,-0.4; 21 4.293,0.4; 22 4.293,1.2; 23 4.293,2; 24 4.293,2.8 | smd 0.559 x 1.27: 9 -2.8,-4.293; 10 -2,-4.293; 11 -1.2,-4.293; 12 -0.4,-4.293; 13 0.4,-4.293; 14 1.2,-4.293; 15 2,-4.293; 16 2.8,-4.293; 25 2.8,4.293; 26 2,4.293; 27 1.2,4.293; 28 0.4,4.293; 29 -0.4,4.293; 30 -1.2,4.293; 31 -2,4.293; 32 -2.8,4.293
TMH-D = drill 0.8 pad 1.5 long: 1 0,6.35; 2 0,3.81; 4 0,-1.27; 5 0,-3.81; 6 0,-6.35
SOIC-8 = smd 1.981 x 0.559: 1 -2.464,1.905; 2 -2.464,0.635; 3 -2.464,-0.635; 4 -2.464,-1.905; 5 2.464,-1.905; 6 2.464,-0.635; 7 2.464,0.635; 8 2.464,1.905
TO247AD = drill 1.499 long: A 5.588,-2.921; C -5.588,-2.921
TO220511 = drill 0.9 long: 1 -3.4,-8.4; 2 -1.7,-4.5; 3 0,-8.4; 4 1.7,-4.5; 5 3.4,-8.4
GA3459 = smd 3.3 x 2: 1 -15,10; 2 -15,6; 3 -15,2; 4 -15,-2; 6 -15,-10; 7 15,-10; 9 15,-2; 10 15,2; 11 15,6; 12 15,10 | smd 3.3 x 1.5: 5 -15,-6; 8 15,-6
AK500/2-H = drill 1.321 long: 1 -2.515,0; 2 2.515,0

### Placement (x,y rotation side)
C1  10.29,73.53 180 bottom
C2  10.29,63.63 0 bottom
C3  6.22,85.34 180 top
C4  64.64,77.34 270 bottom
C5  62.61,77.34 270 bottom
C6  58.2,64.5 225 top
C7  62.99,60.83 45 bottom
C8  56.64,66.04 225 top
C9  43.05,7.24 270 top
C10  57.53,7.24 270 top
C14  153.16,61.47 180 bottom
C15  153.92,39.24 0 bottom
C16  138.05,47.24 270 top
C17  52.07,92.84 90 top
C18  49.53,83.44 180 top
C19  50.8,95.89 0 bottom
C20  7.11,18.8 270 top
C21  10.16,28.96 0 top
C22  8.64,15.75 180 bottom
C23  145.54,72.64 0 bottom
C24  139.83,71.5 0 bottom
C25  149.86,18.8 90 top
C26  27.69,68.58 270 bottom
C27  25.78,63.75 0 top
C28  37.59,59.94 90 bottom
C29  104.52,61.85 270 top
C30  136.65,53.09 0 top
C31  130.56,53.09 0 top
C32  149.35,48.01 270 bottom
C33  100.2,92.2 0 top
C34  81.28,86.49 90 top
C35  53.21,8.38 270 bottom
C36  150.62,79.76 180 bottom
C37  111.51,71.25 90 bottom
C38  140.21,47.24 270 top
C39  109.35,71.25 90 bottom
C40  34.67,94.36 90 top
C41  107.19,87.63 90 bottom
C42  106.68,72.64 180 top
C43  153.03,46.23 180 top
C44  143.64,84.45 180 bottom
C45  100.58,87.25 270 bottom
C46  150.62,52.96 0 top
C47  66.29,72.9 180 top
C50  57.4,13.72 180 bottom
C51  156.97,55.5 90 bottom
CAP_0V  121.16,10.03 270 top
CAP_330V  147.07,10.03 270 top
COIL_IN  129.79,10.03 270 top
COIL_OUT  138.43,10.03 270 top
D1  19.3,11.94 0 bottom
D2  16.51,70.61 90 bottom
D5  128.52,49.91 180 bottom
D6  43.43,92.58 90 bottom
D7  15.75,19.05 270 bottom
D8  110.87,28.57 0 bottom
D9  108.84,34.8 270 bottom
D10  122.56,27.69 0 bottom
D11  121.41,36.7 90 bottom
D12  135.25,47.24 0 top
D13  80.77,14.35 270 bottom
D14  106.3,71.25 180 bottom
D15  18.67,84.71 180 top
D16  2.54,-7.11 0 top  (outside the outline)
D17  2.54,-12.7 0 top  (outside the outline)
F1  11.43,9.65 270 top
H1  155.57,4.45 0 top
H2  155.57,96.01 0 top
H3  4.45,96.01 0 top
H4  4.45,4.45 0 top
IC1  153.03,46.23 0 bottom
IC2  100.08,85.22 270 top
IC3  10.29,68.58 90 bottom
IC4  143.76,80.64 270 bottom
JP1  16.13,78.99 0 top
JP2  16.13,58.67 0 top
JP3  69.6,91.95 0 top
JP4  60.71,91.95 0 top
L1  25.91,91.57 270 top
L5  43.43,91.31 90 top
L6  15.75,20.32 270 top
LED1  110.87,5.46 180 top
LED2  108.33,5.46 180 top
LED3  105.79,5.46 180 top
LED4  34.16,3.05 180 top
LED5  31.62,3.05 180 top
LED6  29.08,3.05 180 top
LED7  26.54,3.05 180 top
LED8  85.22,5.33 180 top
LED9  103.25,5.46 180 top
LED10  12.57,3.05 180 top
OK1  148.34,64.77 0 bottom
OK2  142.49,64.77 0 bottom
Q1  63.63,78.36 0 top
Q2  130.18,20.45 180 top
Q3  56.01,19.81 0 top
Q5  66.67,7.24 270 bottom
Q6  144.91,39.5 0 top
R1  24,61.85 180 bottom
R2  122.3,74.04 90 top
R3  144.91,74.04 270 top
R4  150.62,55.24 180 top
R5  150.62,72.64 0 bottom
R6  154.05,36.7 180 bottom
R7  150.62,57.53 0 top
R8  145.41,75.06 180 bottom
R9  149.35,57.66 90 bottom
R10  139.83,73.79 180 bottom
R11  154.69,55.5 270 bottom
R12  137.54,41.53 270 bottom
R13  129.29,45.59 180 bottom
R14  136.14,65.53 270 bottom
R15  136.65,49.02 270 bottom
R16  67.94,84.33 90 bottom
R17  122.3,61.09 0 bottom
R18  129.29,41.27 180 bottom
R19  122.3,63.37 180 bottom
R20  133.99,30.73 90 top
R21  150.62,77.47 0 bottom
R22  100.2,94.49 180 top
R23  68.83,7.24 90 top
R24  66.42,16.26 270 bottom
R25  50.67,52.83 0 top
R26  50.67,55.12 180 top
R27  44.32,52.45 270 top
R28  65.41,73.28 315 bottom
R29  132.46,47.24 270 top
R30  103.25,71.25 90 bottom
R31  11.18,38.35 180 bottom
R32  19.3,45.47 180 bottom
R33  106.05,25.53 180 bottom
R34  106.05,20.95 180 bottom
R35  106.05,16.38 180 bottom
R36  98.42,25.53 180 bottom
R37  98.42,20.95 180 bottom
R38  98.42,16.38 180 bottom
R39  110.87,10.41 90 top
R40  108.33,10.41 90 top
R41  105.79,10.41 90 top
R42  34.16,8.13 90 top
R43  31.62,8.13 90 top
R44  29.08,8.13 90 top
R45  26.54,8.13 90 top
R46  85.22,10.41 90 top
R47  70.23,84.33 90 bottom
R49  103.25,10.41 90 top
R50  43.43,57.15 45 bottom
R51  122.3,65.79 180 bottom
R52  150.62,75.18 0 bottom
R55  64.01,56.9 225 bottom
R57  66.55,62.23 135 bottom
R58  92.46,85.6 90 top
R59  7.11,11.05 0 top
R70  29.72,31.62 0 top
R101  154.94,30.23 270 bottom
R105  151.89,57.66 90 bottom
R200  80.77,11.43 180 bottom
RJ_1  11.18,38.35 270 top
RJ_2  11.18,50.29 270 top
S1  90.42,94.49 0 top
SJ1  15.75,45.47 0 bottom
SV1  28.07,43.56 90 top
T2  127.76,64.39 90 bottom
T3  76.45,14.22 0 bottom
T4  55.5,53.85 0 top
T5  72.14,88.39 180 bottom
T6  140.34,41.53 180 bottom
U1  27.69,68.58 0 top
U2  81.28,86.49 180 bottom
U3  50.8,92.08 0 bottom
U4  8.38,19.56 180 bottom
U$1  31.24,59.94 0 bottom
U$2  56.77,65.28 225 bottom
U$4  98.93,65.91 0 top
U$5  136.65,57.91 270 bottom
U$6  130.56,57.91 270 bottom
U$7  135.76,14.35 180 top
U$8  20.7,91.82 270 top
U$9  101.73,35.94 90 top
VR1  110.87,5.46 90 bottom
VR2  105.79,5.46 90 bottom
VR3  100.71,5.33 90 bottom
X1  19.3,8 0 top
X2  78.36,7.62 0 top

### Tracks (layer width: path | path; a pad name or v marks a point on that pad's centre or on a via)
24V_PRI  (via drill 0.6)
  Top 0.254: Q3.D 56.01,17.91 54.1,19.81 v48.01,19.81 | v45.59,22.35 v45.59,41.78 | R27.2 v44.32,45.97
  Bottom 0.254: v48.01,19.81 48.01,19.94 v45.59,22.35 | 55.97,13.46 56.01,13.46 C50.1 | v44.32,45.97 44.32,43.05 v45.59,41.78 | C35.1 54.73,9.78 54.74,9.78
  Bottom 1.27: R23.2 64.17,7.66 Q5.4
  Bottom 1.422: Q3.D 56.01,13.46 56.01,10.03 55.75,9.78
  Bottom 1.676: C9.+ 54.74,9.78 55.75,9.78 C10.+ 60.07,7.24 Q5.4
+3V3  (via drill 0.6)
  Top 0.254: U1.2 26.04,70.87 26.29,70.61 26.29,65.91 26.04,65.66 U1.10 | v23.24,34.92 23.24,52.58 18.67,57.15 JP2.4 18.67,60.83 v22.99,65.15 23.5,65.66 U1.10 | R42.2 v34.16,11.05 | C27.1 24.93,65.49 U1.10
  Bottom 0.254: v23.24,34.92 23.24,18.03 30.23,11.05 v34.16,11.05 | v22.99,65.15 19.56,68.58 16.53,68.58 D2.A
  Bottom 0.406: IC3.2 IC3.4 | IC3.4 16.49,68.58 D2.A | C2.1 11.14,66.28 IC3.4
+5V  (via drill 0.6)
  Top 0.254: v26.92,16.26 31.62,11.56 R43.2 | R70.1 v26.8,33.59 | R26.2 49.72,56.33 56.01,62.61 56.01,65.41 C8.2 55.97,65.44 v54.74,66.67 | v100.58,89.41 100.84,89.66 IC2.16 | R58.2 91.31,87.69 91.31,96.37 91.69,96.75 S1.2
  Top 0.305: U1.19 v27.69,70.87
  Top 0.406: 43.43,86.23 L5.1 32.7,86.16 27.69,81.15 v27.69,70.87 27.69,65.66 29.59,63.75 29.59,59.31 | C18.+ 47.13,81.39 47.12,81.38 47.12,70.23 v47.88,69.47 | v32.38,59.31 29.59,59.31 | SV1.2 25.02,40.26 25.02,58.42 25.91,59.31 29.59,59.31 | IC2.16 103.15,96.75 v103.12,96.77 | v81.28,84.2 C34.1 81.11,85.64 79.88,86.87 v53.21,86.87
  Top 0.61: C18.+ 47.88,83.44 51.31,86.87 v53.21,86.87
  Top 0.813: C18.+ 46.16,83.44 L5.1
  Bottom 0.254: v53.21,86.87 53.21,90.12 U3.4 | v26.92,16.26 24.26,18.92 24.26,33.15 26.8,35.69 | 26.8,35.69 SV1.2 | v26.8,33.59 26.8,35.69 | C45.1 v100.58,89.41 | OK2.8 144.4,66.55 144.15,66.29 138.43,66.29 138.05,66.67 138.05,68.83 136.4,70.48 | 136.4,70.48 116.84,70.48 | C44.1 141.6,84.45 141.16,84.01 IC4.8 138.94,82.55 137.79,81.41 137.79,80.14 136.4,78.74 136.4,70.48 | 81.28,85.52 U2.8 | U$2.4 54.74,66.74 v54.74,66.67
  Bottom 0.406: IC3.3 7.14,71.23 C1.1 9.44,74.72 9.91,75.18 13.99,75.18 D2.K 18.31,70.87 v27.69,70.87 C26.1 | 37.88,59.09 C28.1 37.38,59.31 U$1.3 v32.38,59.31 | U$2.4 52.01,69.47 v47.88,69.47 | R17.2 121.16,61.09 116.84,65.41 116.84,70.48 116.84,95.63 115.7,96.77 v103.12,96.77 93.7,96.77 S1.2 S1.1 81.28,90.86 81.28,85.52 v81.28,84.2
+5V/1  (via drill 0.6)
  Top 0.406: R45.2 26.54,12.83 v25.4,13.97
  Top 0.813: U$8.4 19.31,90.12 L1.1 34.63,96.72 C40.+ 38.09,96.76 v38.1,96.77
  Bottom 0.406: v25.4,13.97 4.45,13.97 3.43,14.99 3.43,84.71 4.06,85.34 15.75,85.34 16.26,85.85 16.26,90.07 U$8.4
  Bottom 0.813: v38.1,96.77 38.86,97.54 60.71,97.54 | 60.71,97.54 68.71,97.54 69.6,96.65 JP3.2 | JP4.2 60.71,97.54
+5V/3  (via drill 0.6)
  Top 0.254: v147.7,70.67 144.08,67.06 135,67.06 132.08,69.98 v113.92,69.98
  Bottom 0.254: U$2.19 62.31,61.43 C7.2 64.17,61.43 68.2,57.4 75.44,57.4 86.49,68.45 102.87,68.45 103.25,68.83 R30.1 106.25,70.3 D14.C 109.2,70.25 C39.1 109.35,70.36 109.98,69.72 111.48,69.72 C37.+ 113.69,69.75 v113.92,69.98 | R5.2 v147.7,70.67 OK1.6
+5V/4  (via drill 0.6)
  Top 0.254: v150.24,65.02 150.24,59.05 | 150.24,59.05 151.26,58.04 151.26,57.85 R7.2 | R29.1 135.21,48.19 D12.C 137.9,48.24 C16.1 138.7,48.74 C38.+ 140.21,58.29 140.97,59.05 150.24,59.05
  Bottom 0.254: OK1.8 v150.24,65.02
+12V  (via drill 0.6)
  Top 0.254: L6.1 15.8,25.47 29.08,12.19 R44.2
  Top 0.406: v11.43,25.27 13.69,27.53
  Top 0.61: L6.1 42.62,25.47 43.31,26.16 v43.31,27.81 43.31,28.07
  Top 0.813: C21.+ 12.56,28.66 13.69,27.53 L6.1
  Bottom 0.254: 44.58,29.08 v43.31,27.81
  Bottom 0.406: U4.4 5.92,24.33 6.35,24.77 10.92,24.77 v11.43,25.27
+24V  (via drill 0.6)
  Top 0.254: 3.3,50.29 3.17,50.42 | v6.73,38.35 3.3,38.35 3.17,38.48
  Top 0.305: 52.2,94.49 52.07,94.61
  Top 0.406: v8.64,18.67 6.74,16.77
  Top 0.61: v50.42,92.96 52.07,94.61 C17.+ | C42.+ 103.9,72.26 U$4.1 91.69,72.26 90.17,73.79 90.17,93.6 89.28,94.49 52.2,94.49
  Top 1.676: U$8.1 11.53,95.22 8.64,92.33 8.64,90.16 C3.+ 3.17,84.7 3.17,50.42 3.17,38.48 3.17,20.33 6.74,16.77 C20.+ 11.32,12.19 F1.1
  Bottom 0.254: R30.2 99,72.2 U$4.1 | R31.1 v6.73,38.35
  Bottom 0.406: U4.7 8.89,18.92 v8.64,18.67
  Bottom 0.61: U$8.1 19.97,95.22 22.48,92.71 U3.7 50.16,92.71 v50.42,92.96 | D1.K 11.68,11.94 F1.1
ACTIVATE_BOOSTER  (via drill 0.6)
  Top 0.254: v48.39,50.16 49.72,51.5 R25.1 48.51,52.83 v47.88,53.47
  Bottom 0.254: R24.1 66.42,19.18 48.39,37.21 v48.39,50.16 | U$2.26 47.88,53.56 v47.88,53.47
ACTIVATE_SERVO
  Bottom 0.254: U$2.15 70.23,75.91 R47.1
ADC_24V_LOGIK/SCK_A  (via drill 0.6)
  Top 0.254: v21.84,43.18 16.51,43.18 15.75,42.42 15.75,39.5 v14.61,38.35 | SV1.7 v37.72,54.48 | v46.61,55.24 53.98,62.61 53.98,63.12 v54.86,64.01
  Bottom 0.254: U$2.12 54.93,64.01 v54.86,64.01 | SV1.7 28.07,44.83 23.5,44.83 v21.84,43.18 | v14.61,38.35 R31.2 | v37.72,54.48 39.5,56.26 43.43,56.26 43.65,56.48 R50.1 45.34,55.24 v46.61,55.24
ADC_24V_PRI  (via drill 0.6)
  Top 0.254: v61.59,69.98 55.37,69.98 51.05,65.66 51.05,61.59 44.32,54.86 R27.1
  Bottom 0.254: U$2.13 61.59,69.54 v61.59,69.98 61.59,70.61 63.63,72.64 64.7,72.64 R28.2
ADC_CAP  (via drill 0.6)
  Top 0.254: v144.91,70.23 142.75,72.39 113.67,72.39 110.74,75.31 96.01,75.31 94.61,76.71 v93.09,76.71 | v80.77,76.71 72.99,76.71 69.18,72.9 C47.1 65.24,70.99 v63.63,70.99
  Bottom 0.254: 146.43,70.23 146.43,72.61 C23.1 146.39,75.03 R8.2 146.37,76.65 145.92,77.09 144.53,77.09 144.15,77.47 144.15,79.5 144.65,80.01 IC4.3 | OK1.5 146.43,70.23 | 146.43,70.23 v144.91,70.23 | U$2.14 63.63,70.31 v63.63,70.99 | v80.77,76.71 v93.09,76.71
BOOSTER_24V
  Top 0.305: R46.2 82.99,11.36 80.87,9.25 X2.2
  Bottom 0.305: X2.2 80.87,9.25 81.66,10.03 81.66,11.37 R200.2
  Bottom 1.27: Q5.3 71.47,2.57 71.88,2.16
  Bottom 1.676: R23.1 71.88,2.16 73.15,2.16 | 73.15,2.16 79.5,2.16 80.9,3.56 80.9,7.59 X2.2 | 73.13,2.19 73.15,2.16
CAN_H
  Bottom 0.254: RJ_1.P$3 14.99,40.14 SJ1.2 14.99,48.51 15.81,49.34 RJ_2.P$3 19.05,50.67 19.05,52.32 27.3,60.58 U$1.7
CAN_L
  Bottom 0.254: RJ_1.P$2 20.27,45.45 R32.2 20.25,45.53 21.72,46.99 21.72,49.79 RJ_2.P$2 26.54,57.52 26.54,58.67 27.18,59.31 U$1.6
CAN_RX  (via drill 0.6)
  Top 0.254: v36.45,70.23 36.96,70.23 v38.86,72.14
  Bottom 0.254: U$1.4 31.88,58.04 31.11,58.8 31.11,65.28 35.81,70.23 v36.45,70.23 | v38.86,72.14 52.74,72.14 U$2.7
CAN_TX  (via drill 0.6)
  Top 0.254: v34.8,63.63 40.13,63.63 v45.09,68.58
  Bottom 0.254: U$1.1 33.96,62.79 v34.8,63.63 | U$2.6 52.24,71.5 48.01,71.5 v45.09,68.58
CAP_0V  (via drill 0.6)
  Top 2.184: CAP_0V.P$1 v121.16,14.48 121.16,14.61 124.59,18.03 Q2.S
  Bottom 0.406: U$6.5 132.46,53.98 C31.- | U$5.5 138.56,53.98 C30.-
  Bottom 1.016: Q2.S 124.59,27.67 D10.A 124.61,33.13 123.06,34.67 121.41,34.67 D11.A
  other vias: 97.41,2.79 118.36,14.48 123.83,14.48 154.81,52.45 150.62,46.23 156.84,59.44
  pour Top (isolate 1.27, rank 5): 160.02,63.5 160.02,0 95.76,0 95.76,65.79 114.81,65.79 114.81,63.5
  pour Bottom (isolate 1.27, rank 5): 160.02,63.37 160.02,0 95.76,0 95.76,65.79 114.81,65.79 114.81,57.28 140.21,57.28 140.21,63.37
  pour Top: 95.76,65.79 95.76,1.14 113.03,1.14 113.03,15.62 106.43,15.62 106.43,53.59 114.81,53.59 114.81,55.37 120.78,55.37 121.28,55.88 123.32,55.88 123.83,55.37 124.71,55.37 124.71,40.39 160.02,40.39 160.02,49.4 142.49,49.4 142.49,56.01 147.32,56.01 147.32,49.53 160.02,49.53 160.02,63.5 114.81,63.5 114.81,65.79
  pour Bottom: 147.32,56.01 147.32,30.23 160.02,30.23 160.02,63.5 140.21,63.5 140.21,57.28 124.71,57.28 124.71,51.05 124.08,51.05 124.08,40.39 142.88,40.39 142.88,45.59 142.49,45.59 142.49,56.01
  pour Bottom: 114.81,57.28 114.81,65.79 95.76,65.79 95.76,1.14 113.03,1.14 113.03,8 107.95,8 106.55,9.4 106.55,28.07 101.6,32.89 101.6,48.77 110.11,57.28
CAP_330V
  Top 2.184: U$7.C 141.35,10.16 | C25.+ 147.57,16.26 141.35,10.03
  Top 2.54: 141.35,10.16 141.48,10.03
  Top 3.81: COIL_OUT.P$1 141.35,10.03 141.48,10.03 CAP_330V.P$1
  Bottom 0.254: C25.+ 154.31,16.26 154.94,16.89 R101.2
  Bottom 1.016: D9.K 106.44,32.75 104.9,34.29 104.9,41.4 110.36,46.86 110.36,51.94 112.01,53.59 122.28,53.59 R2.1
  Bottom 1.27: D9.K 108.84,28.59 D8.K 108.84,28.55 R33.2 | 108.82,25.55 R33.2 | R33.2 R34.2 R35.2 108.84,13.96 112.78,10.03 139.32,10.03 141.35,12.06 U$7.C
CAP_+12V  (via drill 0.6)
  Top 0.254: C43.1 154.94,46.23 v155.19,46.48 | 132.4,46.35 R29.2
  Top 0.406: R39.2 110.36,11.36 | 110.36,11.36 R40.2 R41.2 R49.2 103.25,57.28 104.52,58.55 | 110.11,11.62 110.36,11.36 | U$4.6 104.52,59.56 C29.+ 104.52,58.55 | 104.52,58.55 104.78,58.55 106.43,56.9 125.73,56.9 C31.+ 129.54,51.69 | C43.1 153.88,44.92 153.03,44.07 v141.86,44.07 132.97,44.07 132.46,44.58 R29.2 | 132.4,46.35 130.18,46.35 129.54,46.99 129.54,51.69 | 129.54,51.69 134.24,51.69 C30.+
  Bottom 0.254: v155.19,46.48 155.19,47.12 154.94,47.37 IC1.8 | T6.E 141.28,43.49 v141.86,44.07
  Bottom 0.406: U$6.8 128.65,53.98 C31.+ | U$5.8 134.75,53.98 C30.+
CLKOUT_ETH_3V  (via drill 0.6)
  Top 0.254: U1.9 20.95,66.29 v19.68,65.02
  Bottom 0.254: v19.68,65.02 13.34,65.02 12.83,64.52 12.83,62.23 12.06,61.47 11.68,61.47 11.05,60.83 JP2.1
CS_ETH  (via drill 0.6)
  Top 0.254: U1.13 40.11,66.95 v40.64,66.42
  Bottom 0.254: U$2.29 48.31,57.4 46.61,57.4 41.4,62.61 41.4,65.66 v40.64,66.42
CS_ETH_3V  (via drill 0.6)
  Top 0.254: U1.8 17.68,66.95 17.14,66.42 v17.14,63.63
  Bottom 0.254: v17.14,63.63 15.62,63.63 13.59,61.59 JP2.2
D2A  (via drill 0.6)
  Top 0.254: v153.16,75.18 113.16,75.18 111.63,76.71 v96.77,76.71 | v77.6,75.31 72.9,75.31 55.88,58.29 v54.74,58.29
  Bottom 0.254: R52.1 v153.16,75.18 | v96.77,76.71 95.38,75.31 v77.6,75.31 | v54.74,58.29 54.74,59.29 U$2.25
GND  (via drill 0.6)  (93 unrouted)
  Top 0.406: v9.02,20.57 8.38,21.21 7.12,21.21 C20.-
  Top 0.813: C20.- 7.11,28.31 C21.-
  Bottom 0.254: 54.09,68.6 U$2.5
  Bottom 0.406: v9.02,20.57 9.4,20.19 U4.6 14.84,20.19 D7.A | U$1.2 37.38,60.58 C28.2 | U3.6 44.34,91.44 D6.A
  Bottom 0.813: U$8.3 U$8.5
  other vias: 34.92,30.61 33.02,26.67 34.67,23.11 55.88,67.82 59.05,66.55 21.34,16.51 105.66,86.74 48.9,73.03 48.77,70.61 18.29,66.04 45.34,62.74 65.15,58.67 90.3,72.14 13.08,72.14
  pour Bottom: 0,0 42.8,0 42.8,38.86 51.44,47.5 75.31,47.5 94.87,67.06 116.08,67.06 116.08,58.55 138.81,58.55 138.81,64.77 160.02,64.77 160.02,100.08 147.32,100.08 147.32,92.08 119.89,92.08 119.89,100.08 0,100.08
  pour Top: 0,0 42.8,0 42.8,38.86 51.44,47.5 75.31,47.5 94.87,67.06 116.08,67.06 116.08,64.77 160.02,64.77 160.02,100.08 147.32,100.08 147.32,92.08 119.89,92.08 119.89,100.08 0,100.08
GND1  (via drill 0.6)  (13 unrouted)
  Top 1.016: C9.- 45.34,4.7
  Top 1.778: 75.81,7.66 X2.1
  other vias: 49.78,27.18 49.15,21.46 48.01,14.35 50.16,4.19 72.64,21.84 44.32,34.67 54.86,37.34
  pour Bottom (isolate 0.406, rank 3): 42.8,0 94.49,0 94.49,66.67 75.31,47.5 51.44,47.5 42.8,38.86
  pour Top (isolate 0.406, rank 3): 42.8,0 94.49,0 94.49,66.67 75.31,47.5 51.44,47.5 42.8,38.86
INT_ETH  (via drill 0.6)
  Top 0.254: v33.15,72.14 32.51,71.5 U1.20
  Bottom 0.254: U$2.30 52.84,63.13 48.13,58.42 46.48,58.42 42.42,62.48 42.42,66.17 36.45,72.14 v33.15,72.14
INT_ETH_3V
  Top 0.254: U1.1 22.99,71.5 21.21,73.28 JP1.5
KICK  (via drill 0.6)
  Top 0.254: v118.49,68.58 90.81,68.58 v76.83,54.61
  Bottom 0.254: 121.28,63.37 R19.1 119.13,65.6 119.13,67.94 v118.49,68.58 | v76.83,54.61 64.61,54.61 U$2.23
KICK_VOLTAGE
  Bottom 0.254: R5.1 151.57,72.84 150.62,73.79 150.62,74.23 R52.2 R21.2 149.67,79.66 C36.1 149.77,79.84 148.34,81.28 IC4.2
LINE  (via drill 0.6)  (2 unrouted)
  Top 0.254: R70.2 v38.23,31.62 38.23,39.03
MISO  (via drill 0.6)
  Top 0.254: U1.17 32.08,69.55 v36.45,73.91
  Bottom 0.254: v36.45,73.91 52.15,73.91 U$2.8
MISO_3V
  Top 0.254: U1.4 22.91,69.55 16.13,76.33 JP1.3
MOSI  (via drill 0.6)
  Top 0.254: U1.16 33.22,68.91 v39.62,75.31
  Bottom 0.254: v39.62,75.31 52.86,75.31 U$2.9
MOSI_3V
  Top 0.254: U1.5 22.53,68.91 13.59,77.85 JP1.2
N$1  (via drill 0.6)
  Top 0.406: L5.2 45.65,96.46 v45.72,96.39
  Bottom 0.406: C19.2 49.95,95.59 U3.8 45.85,93.98 | 45.85,93.98 44.09,93.98 D6.K | v45.72,96.39 45.72,94.11 45.85,93.98
N$2  (via drill 0.6)
  Top 0.254: v110.11,2.67 110.62,2.67 110.87,2.92 LED1.C
  Bottom 0.254: VR1.1 109.77,3 v110.11,2.67
N$3
  Bottom 0.254: C19.1 51.65,95.59 U3.1
N$4
  Bottom 0.254: R1.2 U$1.8
N$5  (via drill 0.6)
  Top 0.254: v66.29,76.58 66.67,76.58 Q1.2
  Bottom 0.254: C4.2 66.21,76.49 v66.29,76.58 66.29,76.52 63.88,74.11 U$2.11
N$6  (via drill 0.6)
  Top 0.254: v61.09,76.58 60.58,76.58 Q1.1
  Bottom 0.254: C5.2 61.17,76.49 v61.09,76.58 61.09,72.39 58.46,69.77 U$2.10
N$9
  Bottom 0.254: R32.1 SJ1.1
N$10  (via drill 0.6)
  Top 0.254: v58.42,62.99 57.6,63.81 C6.2
  Bottom 0.254: U$2.21 58.49,62.99 v58.42,62.99
N$12
  Bottom 0.254: 99.31,25.47 R36.2 R33.1 103.25,24.77 105.28,22.73 105.28,8.26 107.13,6.41 VR1.2
N$13
  Bottom 0.254: R105.1 151.89,52.45 152.27,52.07 153.16,52.07 154.31,50.93 154.31,47.5 153.8,46.99 153.8,45.72 154.94,44.58 IC1.1
N$14
  Bottom 0.254: IC1.2 153.67,42.67 154.43,41.91 155.7,41.91 156.08,42.29 156.08,53.15 R11.2 | R11.2 154.24,54.99 154.05,54.99 153.29,55.75 153.29,59.56 152.31,60.54 C14.1 152.27,61.51 152.27,61.72 150.5,63.5 149.35,63.5 148.97,63.88 OK1.7 | C51.1 154.69,54.65 R11.2
N$15
  Bottom 0.254: R101.1 155,33.09 R6.2 154.77,36.93 C15.1 154.77,40.42 152.4,42.8 IC1.3 152.4,46.74 152.02,47.12 151.38,47.12 151.13,47.37 IC1.5 151.1,48.86 C32.1
N$21
  Bottom 0.254: OK1.1 150.24,60.26 R105.2
N$22
  Bottom 0.254: OK1.2 OK1.3
N$23
  Top 1.676: R2.2 R3.1
N$24
  Bottom 1.016: R3.2 Q6.D
N$25
  Bottom 0.254: IC1.7 153.67,50.67 152.91,51.44 151.26,51.44 150.88,51.82 150.88,55.18 R9.1
N$26  (via drill 0.6)
  Top 0.406: L6.2 15.68,15.24 v13.46,15.24
  Bottom 0.406: 13.34,17.65 U4.8 10.79,17.6 10.79,16.76 9.78,15.75 C22.2 | 13.34,17.65 15.1,17.65 D7.K | v13.46,15.24 13.46,17.53 13.34,17.65
N$27  (via drill 0.6)
  Top 0.254: v149.73,50.93 149.73,52.92 C46.1 149.77,55.15 R4.2 R7.1
  Bottom 0.254: IC1.6 152.4,50.29 152.15,50.55 150.11,50.55 v149.73,50.93
N$30
  Top 0.406: R59.2 8.06,10.73 11.43,7.37 F1.2
  Top 1.676: X1.1 15.9,7.11 F1.2
N$33
  Bottom 0.406: C22.1 6.6,15.75 5.97,16.38 5.97,17.6 U4.1
N$34  (1 unrouted)
  Bottom 1.016: 115.73,27.69 D10.K | 114.84,28.57 D8.A
N$35
  Bottom 0.254: OK2.1 144.4,59.69 145.48,58.61 R9.2
N$36  (1 unrouted)
  Bottom 1.016: 110.68,38.69 D9.A | 115.79,38.75 D11.K
N$37  (via drill 0.6)
  Top 0.254: IC2.10 v99.44,82.04
  Bottom 0.254: v99.44,82.04 80.01,82.04 79.45,82.6 U2.1
N$38  (via drill 0.6)  (1 unrouted)
  Top 0.254: IC2.1 v94.23,89.66
  Bottom 0.254: 89.86,87.45 92.08,89.66 v94.23,89.66
N$39
  Bottom 0.406: Q6.G 140.84,36.96 140.34,37.47 T6.C 140.19,40.58 R12.2
N$40
  Bottom 0.254: U$5.2 136.02,64.45 R14.2
N$41
  Bottom 0.254: R15.1 136.65,55.32
  Bottom 0.305: 136.65,55.32 136.53,55.45
  Bottom 0.406: U$5.7 136.53,55.45 U$5.6
N$42
  Top 0.254: R58.1 96.94,84.65 IC2.5
N$43
  Bottom 0.254: U$6.2 129.92,61.72 129.67,61.98 125.98,61.98 125.09,61.09 R17.1
N$44
  Bottom 0.305: D5.K 130.57,55.34 130.68,55.45
  Bottom 0.406: U$6.7 130.68,55.45 U$6.6 | D5.K 130.57,49.67 129.16,48.26 129.16,44.32 126.49,41.65 R18.1 126.49,40.01
N$45  (2 unrouted)
N$46
  Bottom 0.406: T6.B 139.38,45.34 R15.2
N$47
  Bottom 0.254: T2.1 126.72,63.37 R19.2 R51.2
N$48
  Bottom 0.406: Q2.G 135.76,25.91 134.11,27.56 134.11,37.21 132.08,39.24 132.08,40 R18.2 R13.2
N$49
  Top 2.184: COIL_IN.P$1 130.18,10.41 U$7.A Q2.D R20.2
N$50  (via drill 0.6)
  Top 0.254: v144.02,82.17 141.48,79.63 124.08,79.63 123.19,80.52 123.19,87.88 120.4,90.68 v111.38,90.68
  Bottom 0.254: IC4.1 144.4,82.55 v144.02,82.17 | U2.6 93.93,86.82 97.79,90.68 v111.38,90.68
N$51
  Bottom 0.254: U$2.22 62.78,57.57 R55.1
N$52
  Top 0.254: R25.2 51.67,52.75 T4.1
N$53
  Bottom 0.406: D5.A 126.47,44.2 R13.1
N$54
  Bottom 0.254: Q5.1 73.53,9.52 74.93,10.92 79.31,10.92 R200.1
  Bottom 0.305: D13.C 79.82,14.3 R200.1
N$55
  Bottom 0.305: T3.3 76.48,15.35 D13.A
N$56
  Bottom 0.254: T3.1 77.4,12.76 76.45,11.81 73.79,11.81 70.29,15.31 R24.2
N$58  (via drill 0.6)  (1 unrouted)
  Top 0.254: R26.1 51.67,54.95 T4.3 56.73,54.95 v72.39,70.61
  Bottom 0.254: 78.03,86.16 72.39,80.52 v72.39,70.61
N$59
  Bottom 0.254: U$2.17 62.63,63.37 64.06,63.37 R57.1
N$60
  Bottom 0.254: R37.2 R34.1 103.25,20.07 104.65,18.67 104.65,6.45 VR2.2
N$61
  Bottom 0.254: R35.1 R38.2 99.61,16.15 VR3.2
N$62  (via drill 0.6)
  Top 0.254: LED2.C 108.33,3.43 v107.7,2.79
  Bottom 0.254: VR2.1 104.69,3.13 105.03,2.79 v107.7,2.79
N$63  (via drill 0.6)
  Top 0.254: LED3.C 105.79,3.43 105.16,2.79 v100.2,2.79
  Bottom 0.254: VR3.1 99.61,3.39 v100.2,2.79
N$64
  Top 0.406: R39.1 LED1.A
N$65
  Top 0.406: R40.1 LED2.A
N$66
  Top 0.406: R41.1 LED3.A
N$67
  Top 0.254: R42.1 LED4.A
N$69
  Top 0.406: D15.K 16.62,86.89 | 16.62,86.89 13.84,89.66 13.84,90.55 16.26,92.96 16.26,93.47 U$8.2 | L1.2 23.18,86.42 22.73,86.87 16.64,86.87 16.62,86.89
N$70
  Bottom 0.813: T5.1 72.16,91.92 JP3.3
N$71
  Top 0.254: R45.1 LED7.A
N$72
  Top 0.254: R43.1 LED5.A
N$73
  Top 0.254: R44.1 LED6.A
N$74
  Top 0.305: R46.1 LED8.A
N$75
  Bottom 0.254: R16.2 R47.2 72.45,85.28 73.13,85.95 T5.3
N$76
  Top 0.406: R49.1 LED9.A
N$77
  Top 0.254: R59.1 6.16,9.33 11.4,4.1 LED10.A
NOTAUS  (via drill 0.6)  (1 unrouted)
  Top 0.254: v136.14,68.45 133.22,71.37 101.09,71.37 100.71,70.99 91.19,70.99 90.61,70.42 | 90.61,70.42 76.2,56.01 v69.98,56.01 65.02,51.05 51.31,51.05 44.7,44.45 | v88.27,85.09 88.27,72.77 90.61,70.42
  Bottom 0.254: v136.14,68.45 R14.1 | v88.27,85.09 87.2,86.16 U2.7 | R55.2 64.9,56.01 v69.98,56.01
OC0A/MOSI_A  (via drill 0.6)
  Top 0.254: SV1.1 30.86,40.01 30.86,42.93 49.78,61.85 v49.78,67.44 v49.78,80.64
  Bottom 0.254: v49.78,67.44 51.69,67.44 52.23,66.9 U$2.2 | JP4.1 58.17,89.03 v49.78,80.64
OC1A_FREQ/MISO_A  (via drill 0.6)
  Top 0.254: SV1.9 46.35,65.66 v48.26,65.66
  Bottom 0.254: v48.26,65.66 51.08,65.66 U$2.1 | SV1.9 29.34,51.37
RESET_NOTAUS  (via drill 0.6)
  Top 0.254: IC2.15 108.84,88.39 109.22,88.01 109.22,83.69 108.84,83.31 IC2.11 v100.97,83.31 | v60.58,57.15 68.71,65.28 72.26,65.28 v86.61,79.63
  Bottom 0.254: v100.97,83.31 100.97,80.9 100.58,80.52 87.5,80.52 v86.61,79.63 | U$2.24 60.58,57.51 v60.58,57.15
RST  (via drill 0.6)
  Top 0.254: SV1.5 40.51,54.74 40.51,55.63 v46.23,61.34
  Bottom 0.254: U$2.31 49.98,61.34 v46.23,61.34
RST_ETH  (via drill 0.6)
  Top 0.254: U1.14 38.66,67.61 v41.15,70.1
  Bottom 0.254: U$2.32 50.76,63.25 48.01,63.25 43.94,67.31 43.69,67.56 v41.15,70.1
RST_ETH_3V
  Top 0.254: U1.7 16.82,67.61 16.13,66.93 JP2.3
SCK  (via drill 0.6)
  Top 0.254: U1.15 36.75,68.25 v37.21,68.71
  Bottom 0.254: U$2.28 48.42,56.39 46.23,56.39 38.48,64.14 38.48,68.33 38.1,68.71 v37.21,68.71
SCK_3V
  Top 0.254: U1.6 22.17,68.25 14.35,76.07 11.3,76.07 11.05,76.33 JP1.1
SERVO_PWM  (via drill 0.6)
  Top 0.254: v51.31,68.45 v51.31,78.36
  Bottom 0.254: U$2.3 52.8,67.47 51.82,68.45 v51.31,68.45 | v51.31,78.36 51.31,79.12 60.96,88.77 66.42,88.77 67.06,89.41 JP3.1
STBY  (via drill 0.6)
  Top 0.254: v64.9,65.28 v57.4,57.78
  Bottom 0.254: U2.3 77.55,86.82 71.63,80.9 71.63,72.01 v64.9,65.28 67.22,62.95 R57.2 | 36.66,40.35 52.83,56.52 56.13,56.52 v57.4,57.78
TASTER
  Top 0.254: IC2.14 99.69,87.12 99.31,87.5 99.31,92.16 C33.1 99.33,92.23 | S1.4 99.33,92.23 | 99.33,92.23 99.33,94.41 R22.2
  Bottom 0.406: S1.3 S1.4
WOL_ETH_3V
  Top 0.254: U1.3 23.27,70.21 18.67,74.8 JP1.4
ÜBERSPANNUNG  (via drill 0.6)
  Top 0.254: v139.32,76.83 123.06,76.83 121.03,78.87 121.03,86.36 120.27,87.12 v112.01,87.12 | v106.55,84.58 IC2.12
  Bottom 0.254: OK2.7 143.13,70.87 142.49,71.5 C24.1 140.78,71.6 R10.2 140.78,75.38 v139.32,76.83 | v112.01,87.12 107.53,87.12 C41.1 107.19,85.22 v106.55,84.58